# Altium project Score.PrjPCB (part 1 of 2)
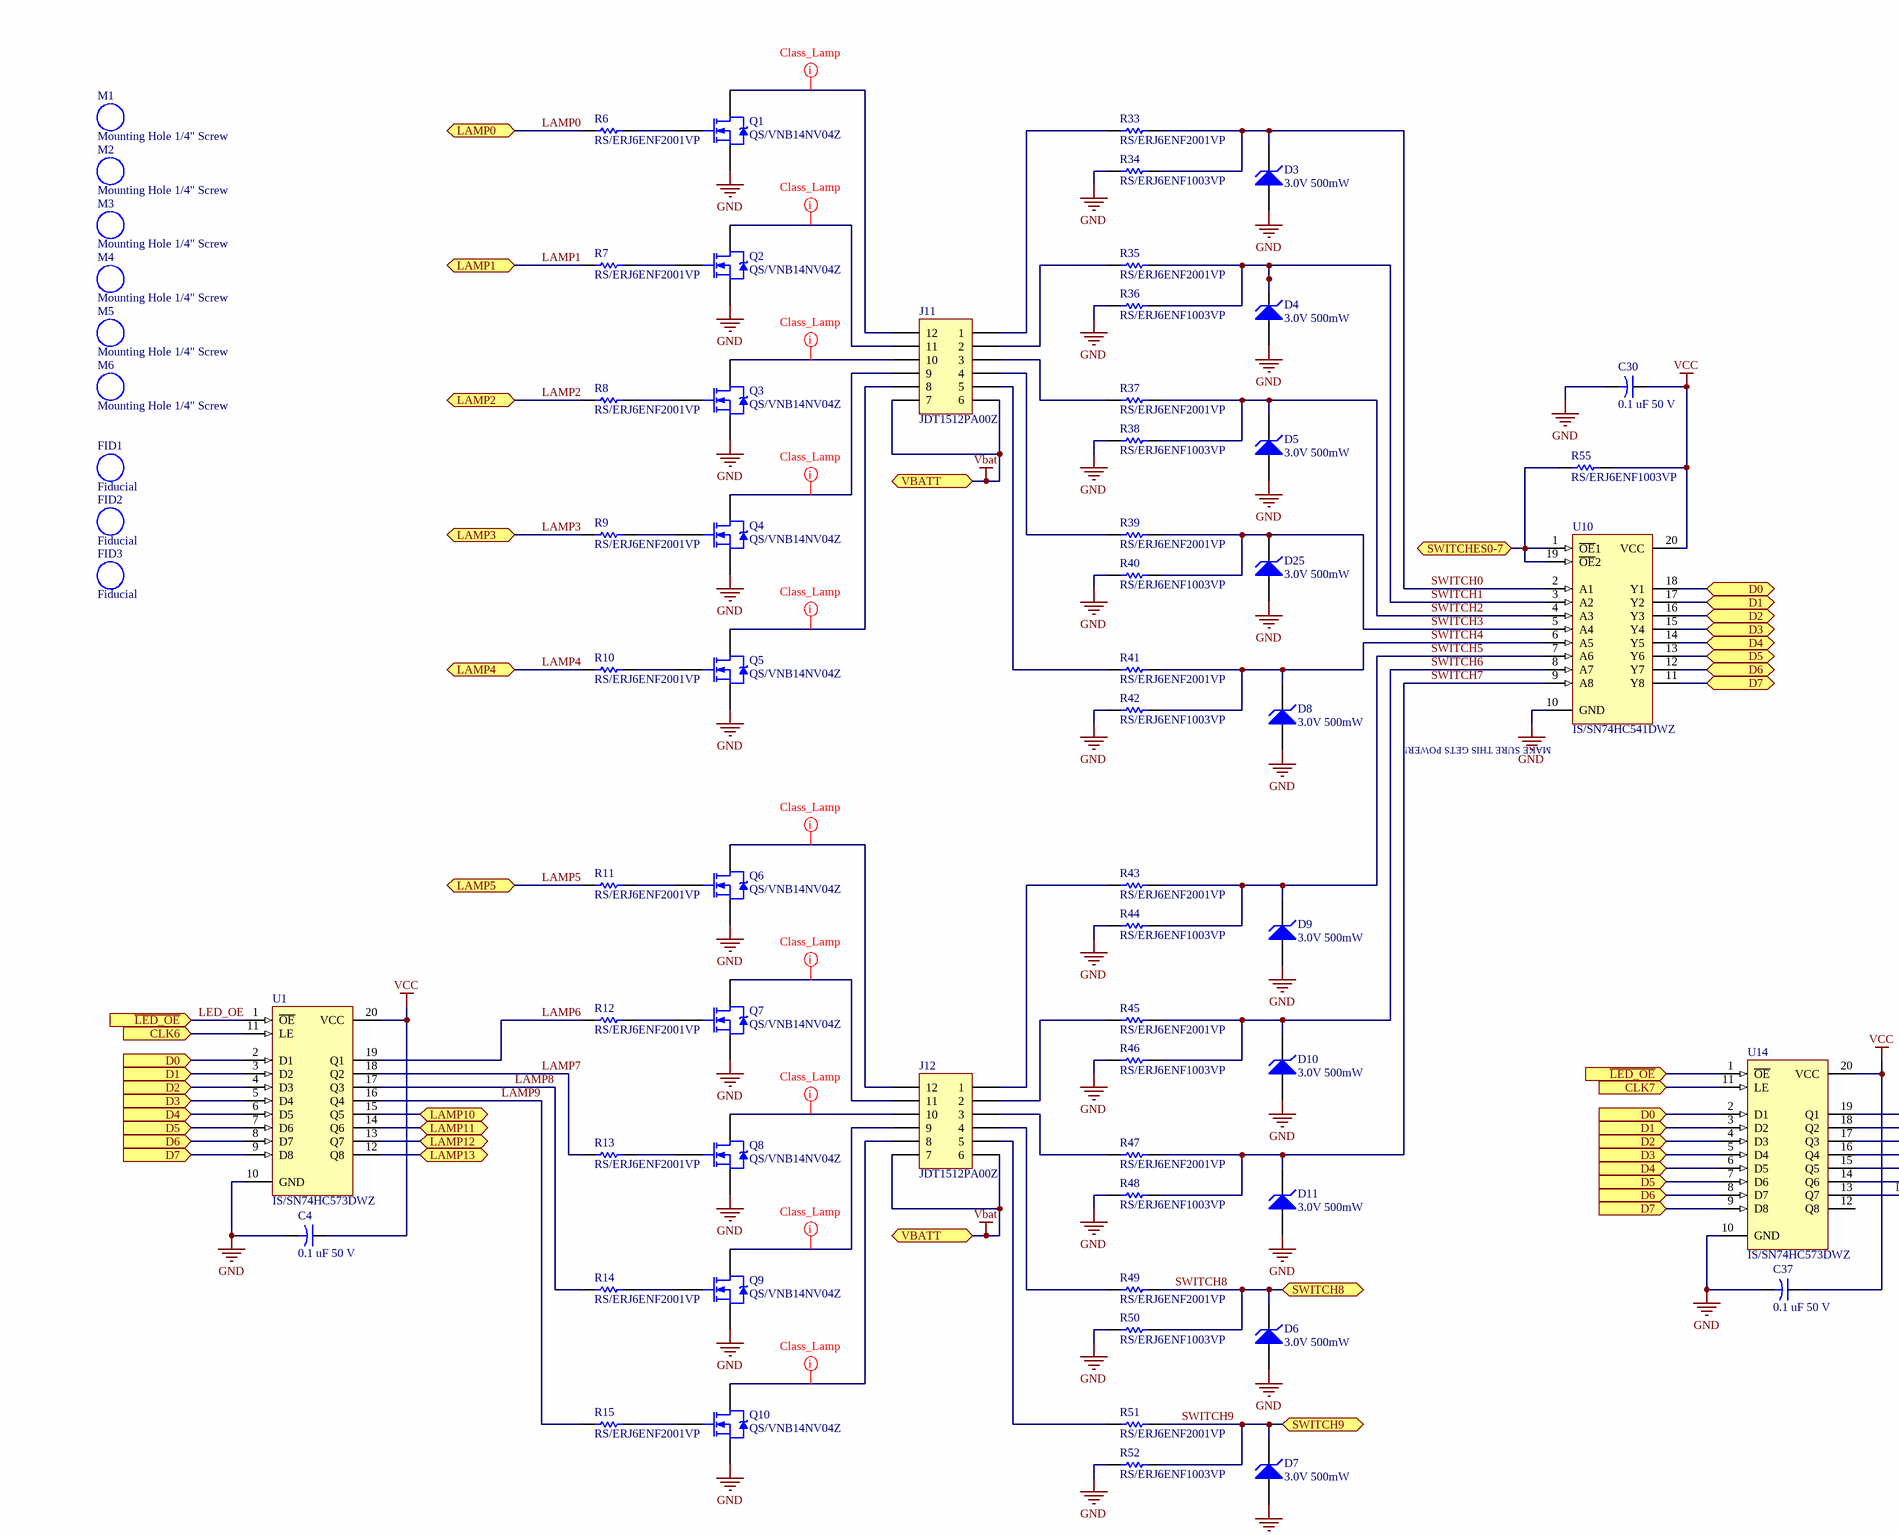
[diagram p0: Score V4.SchDoc, top left]
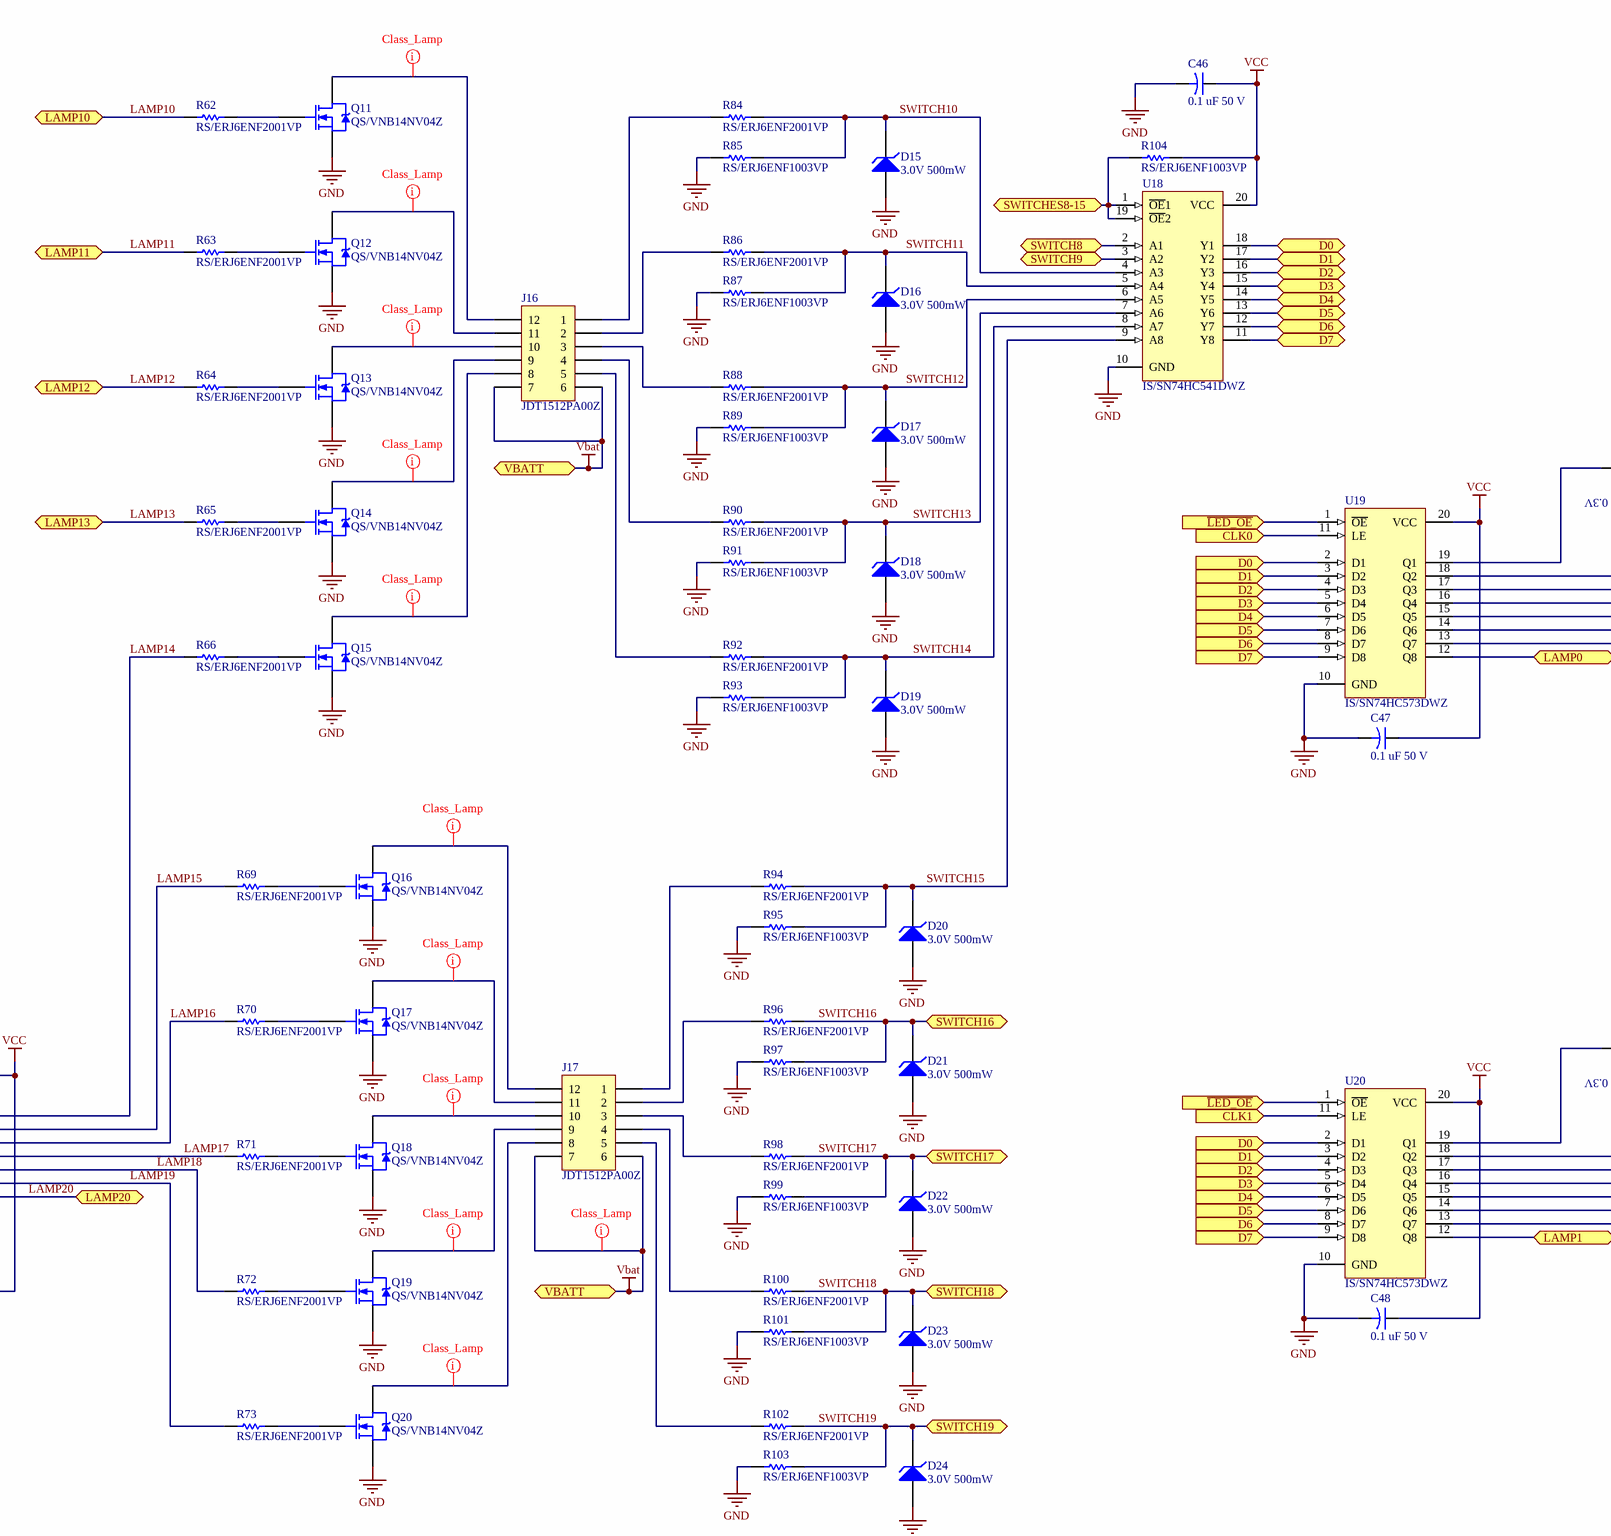
[diagram p1: Score V4.SchDoc, top middle]
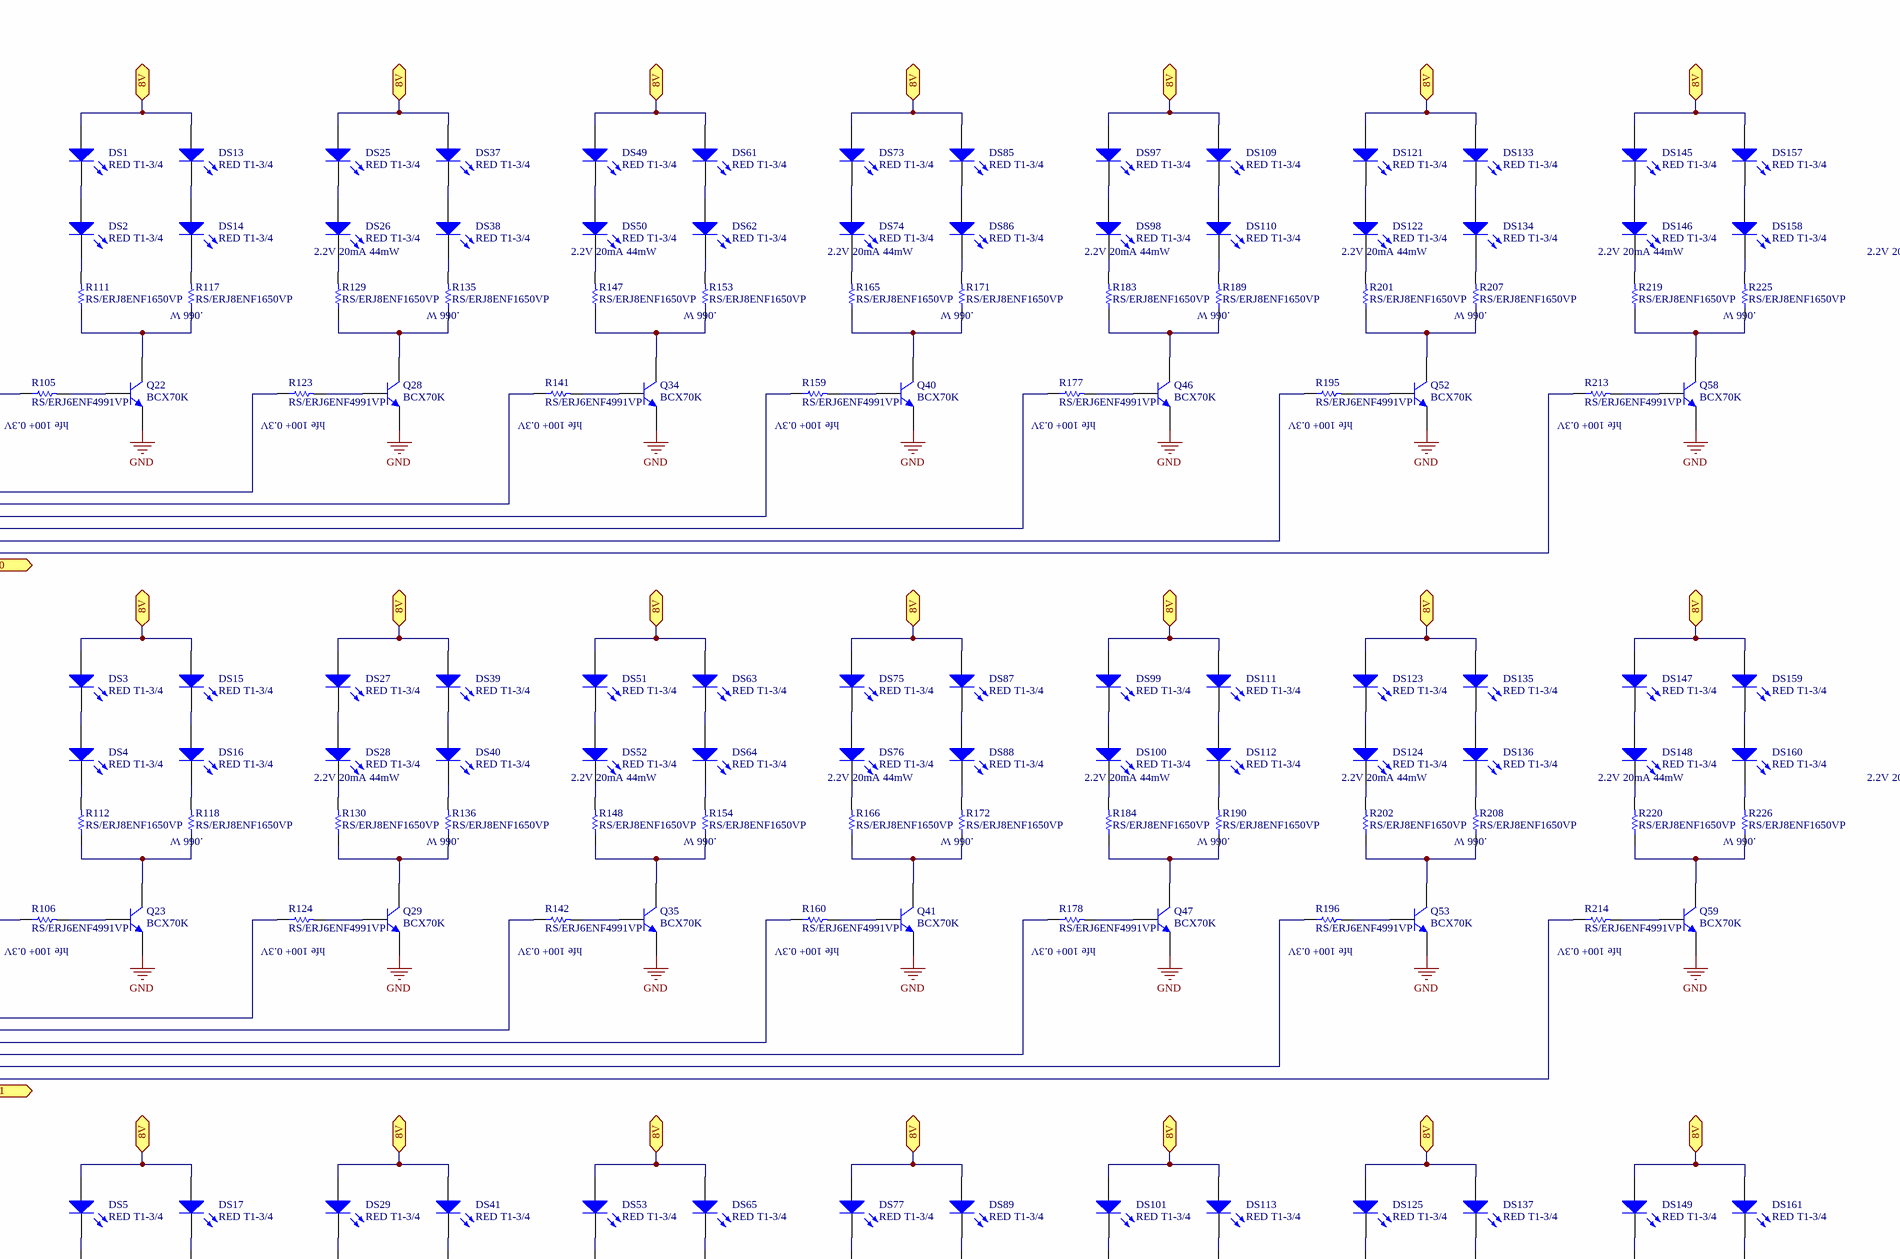
[diagram p2: Score V4.SchDoc, top right]
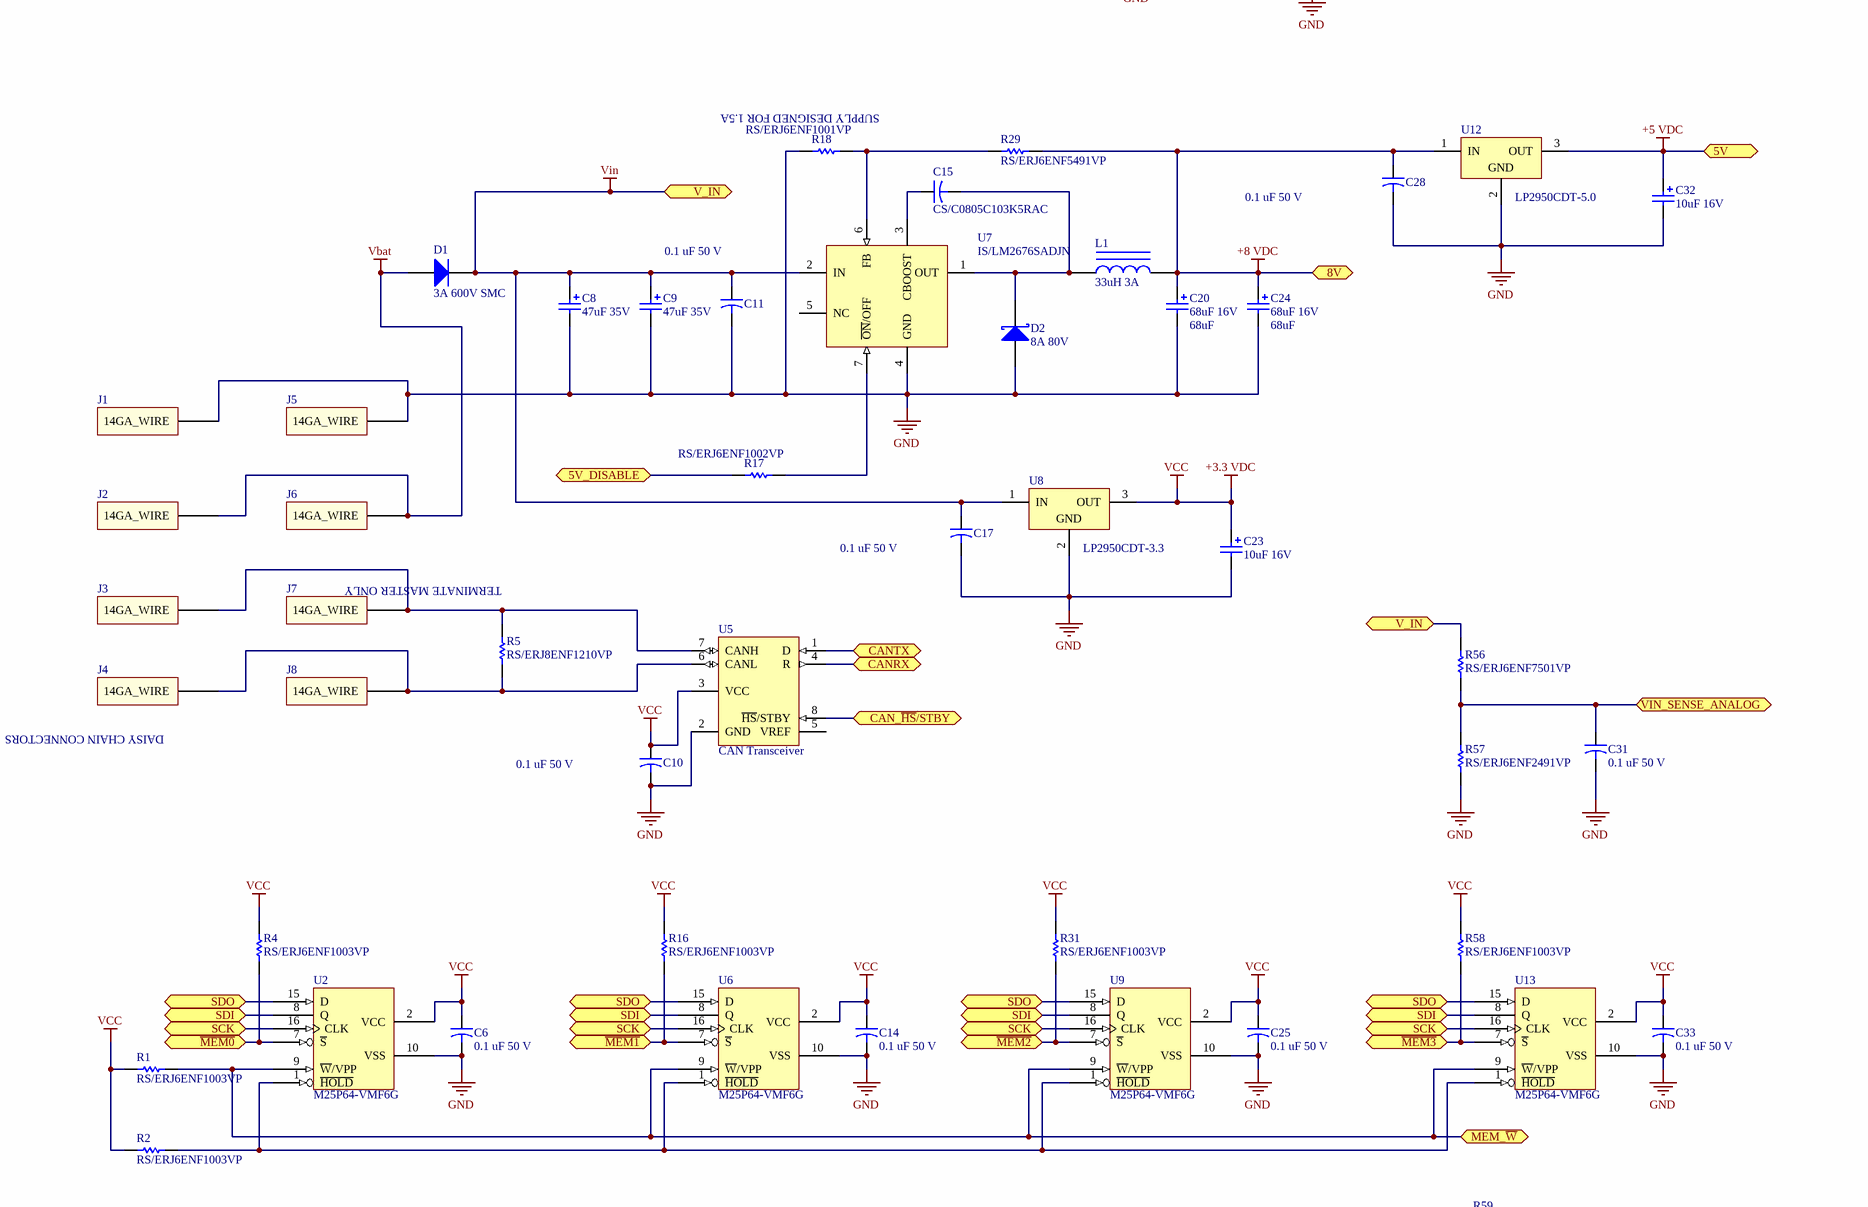
[diagram p3: Score V4.SchDoc, centre left]
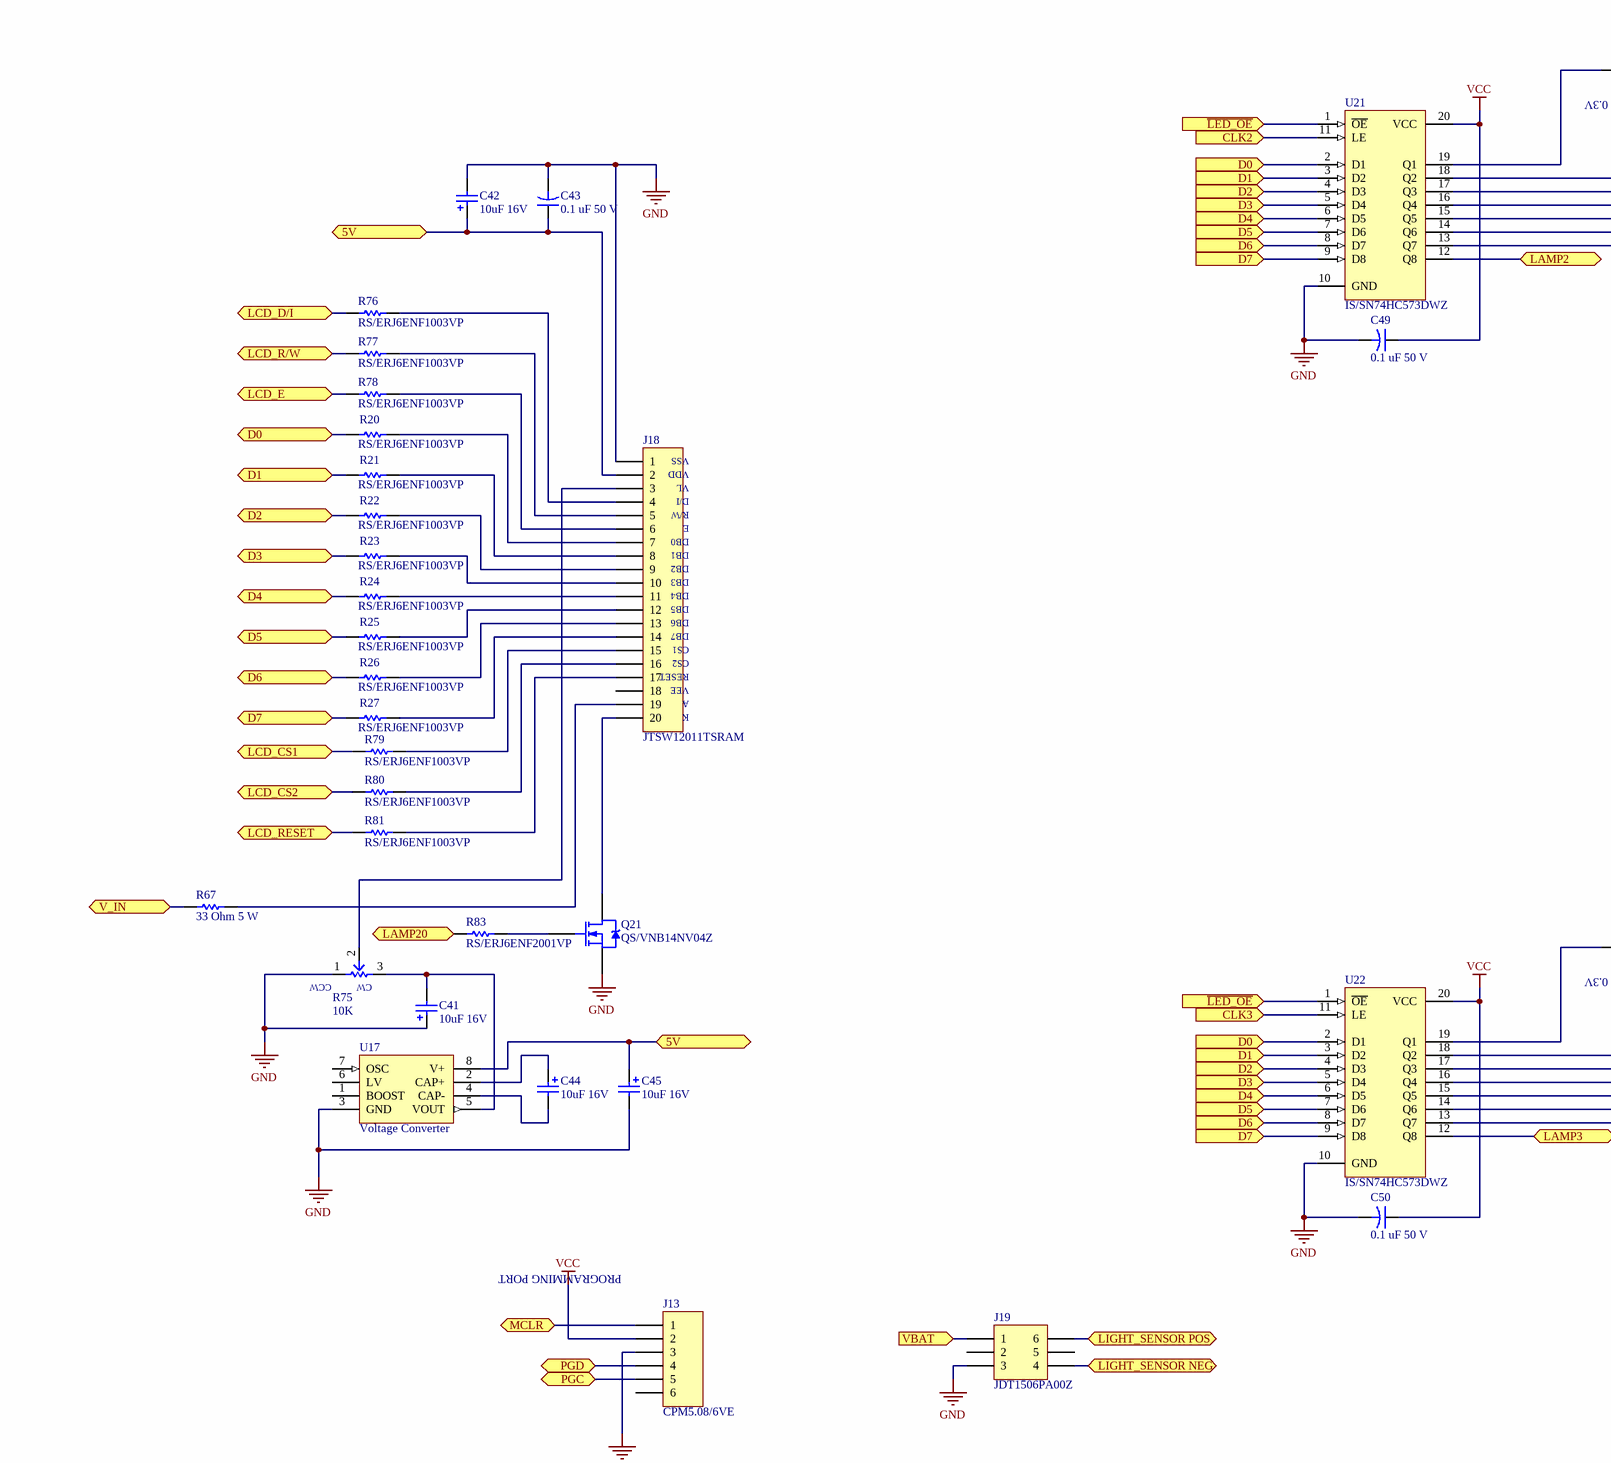
[diagram p4: Score V4.SchDoc, centre middle]
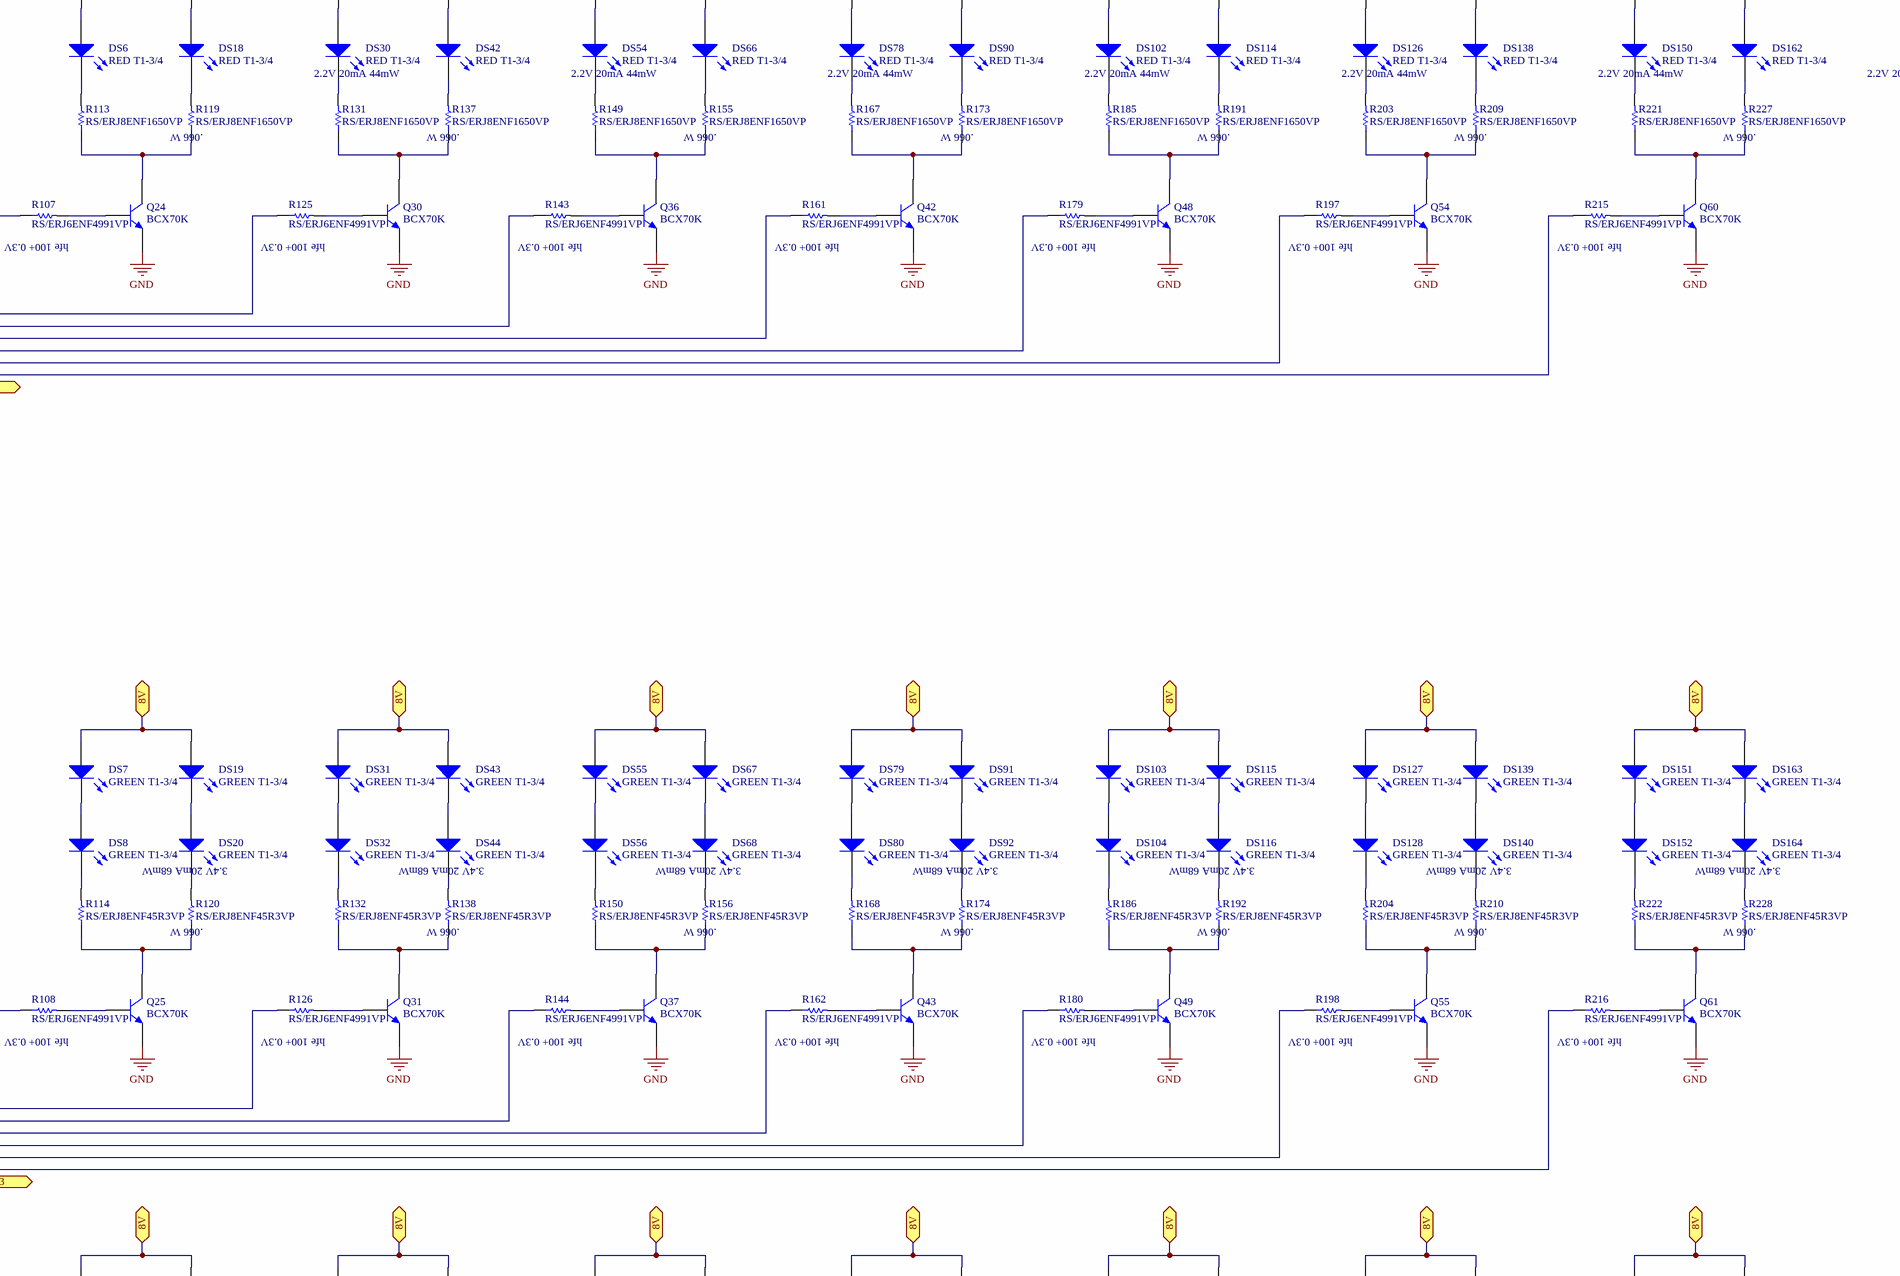
[diagram p5: Score V4.SchDoc, centre right]
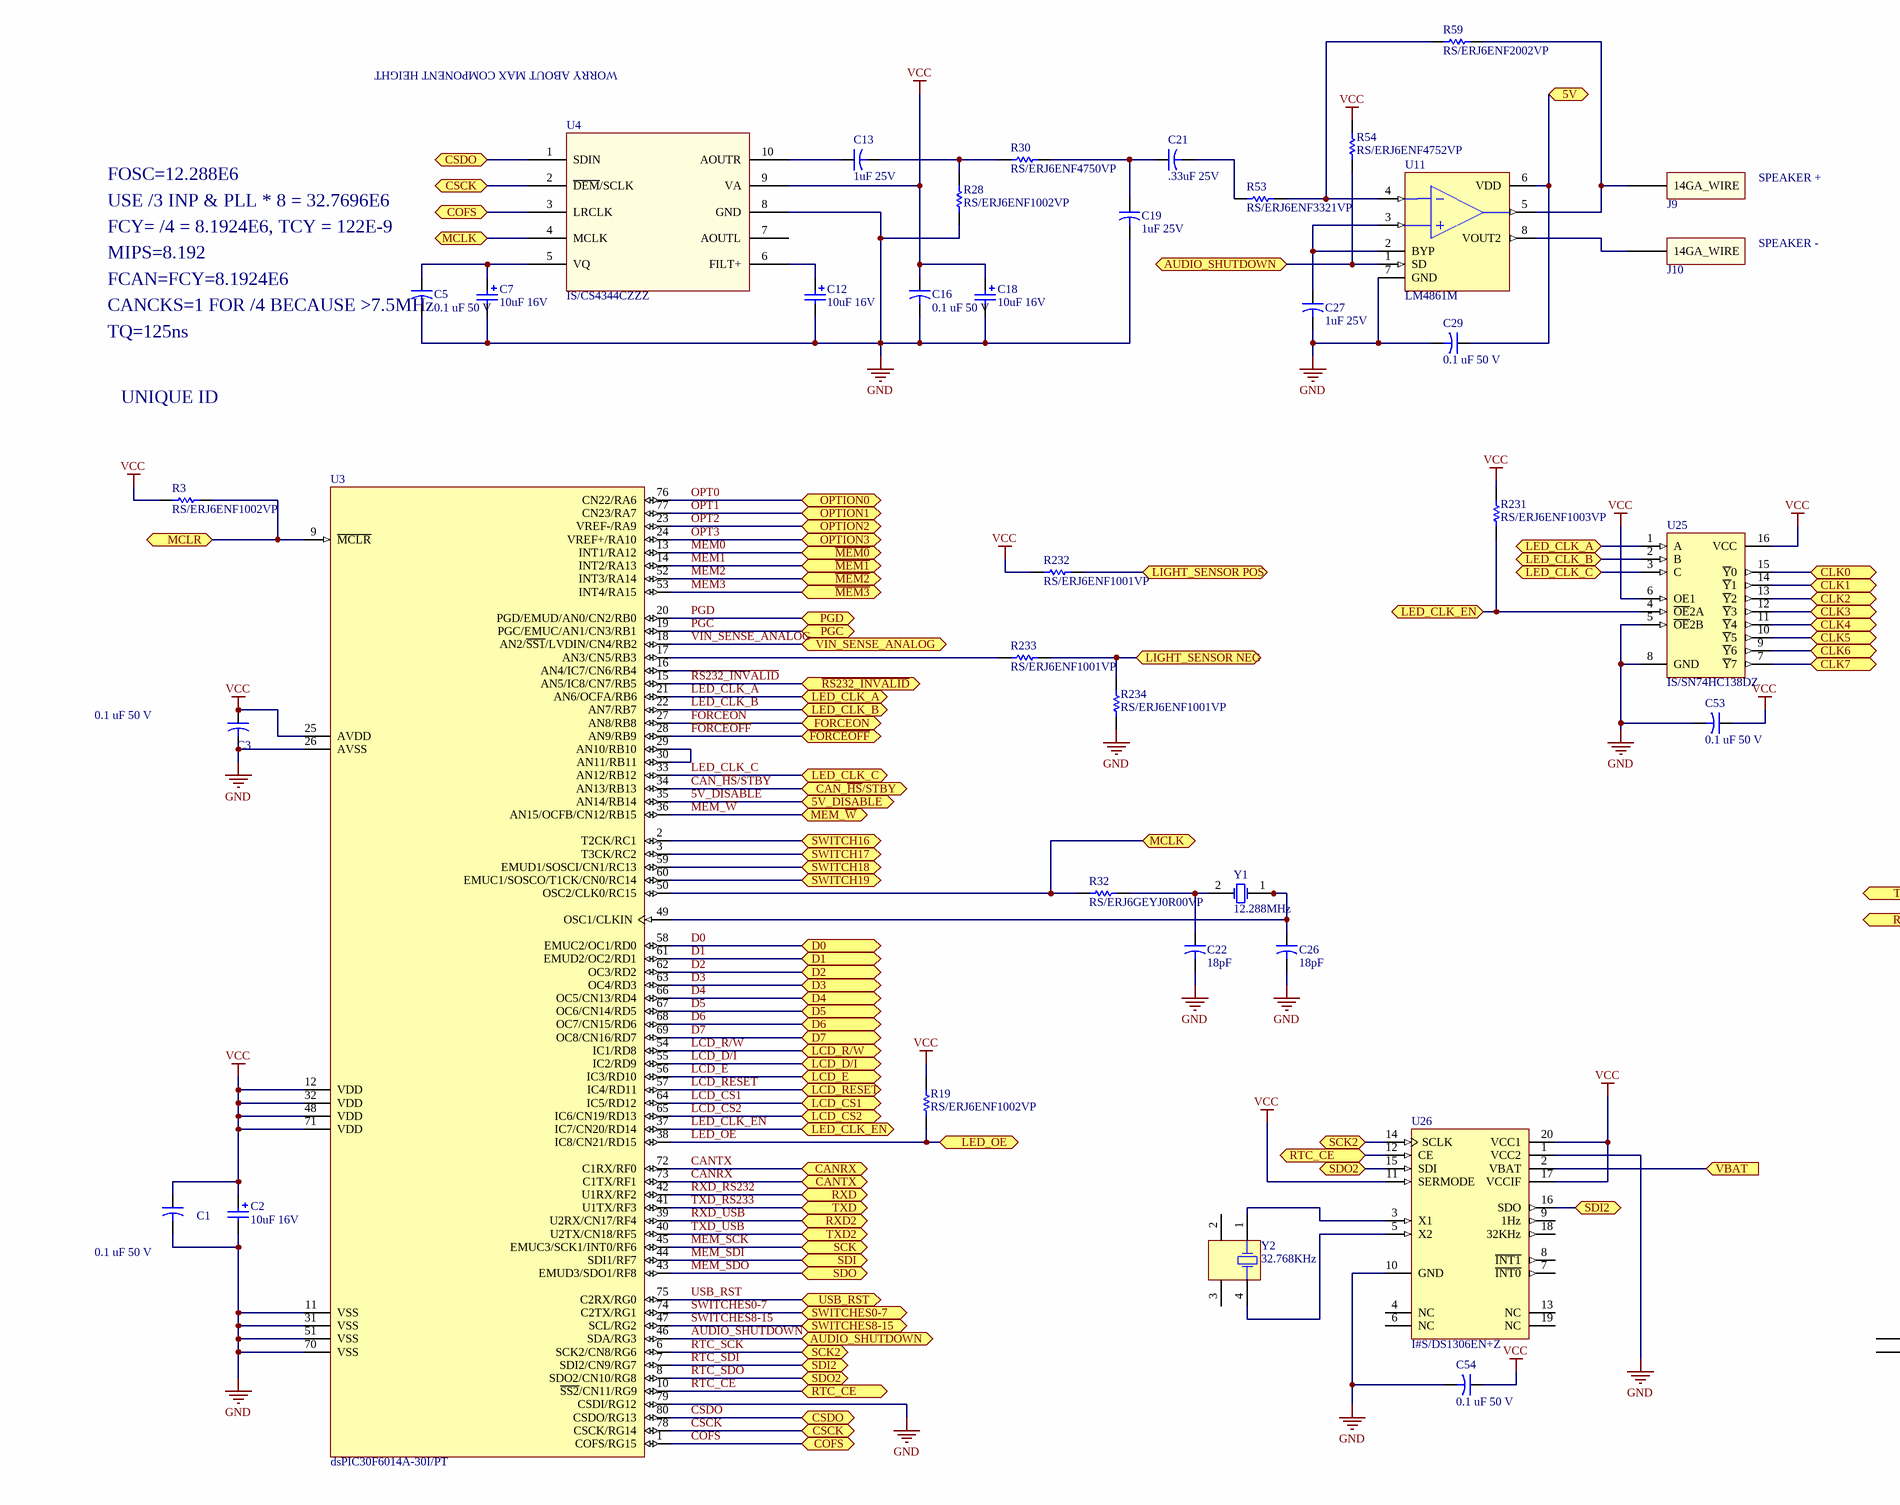
[diagram p6: Score V4.SchDoc, bottom left]
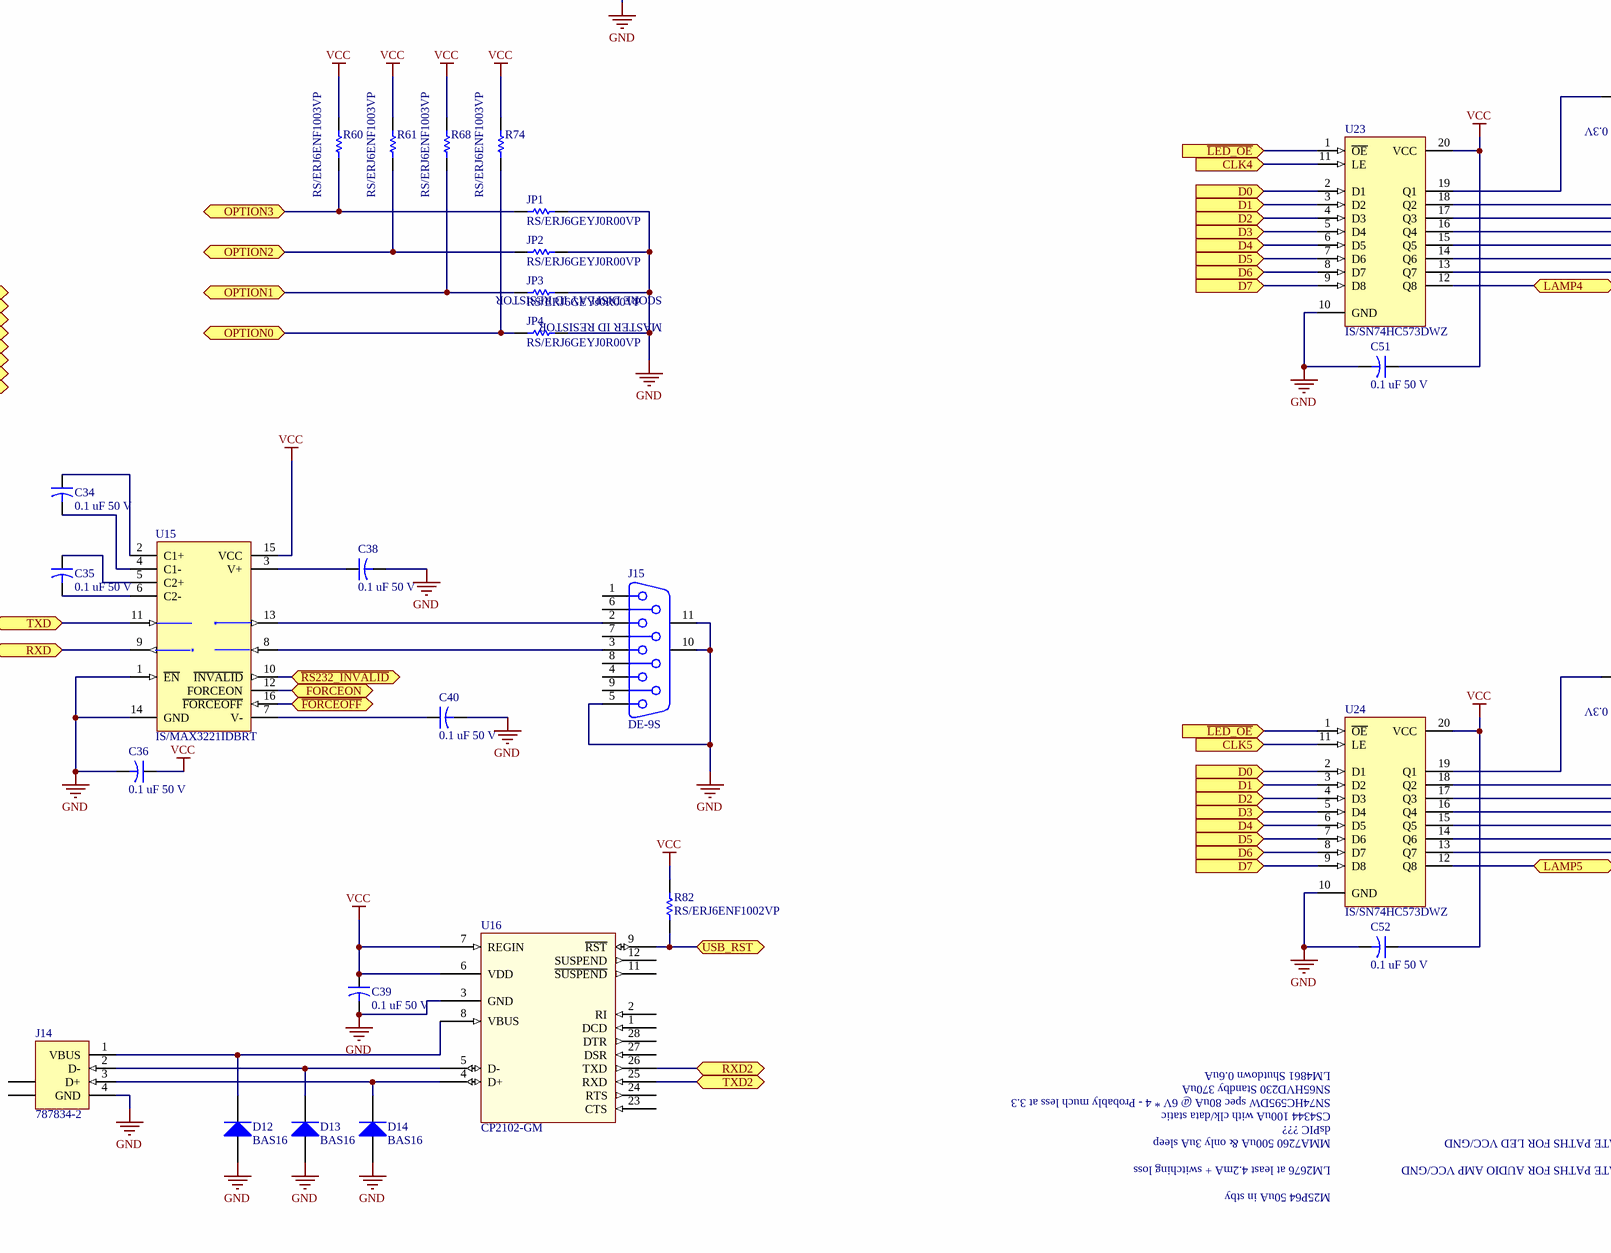
[diagram p7: Score V4.SchDoc, bottom middle]
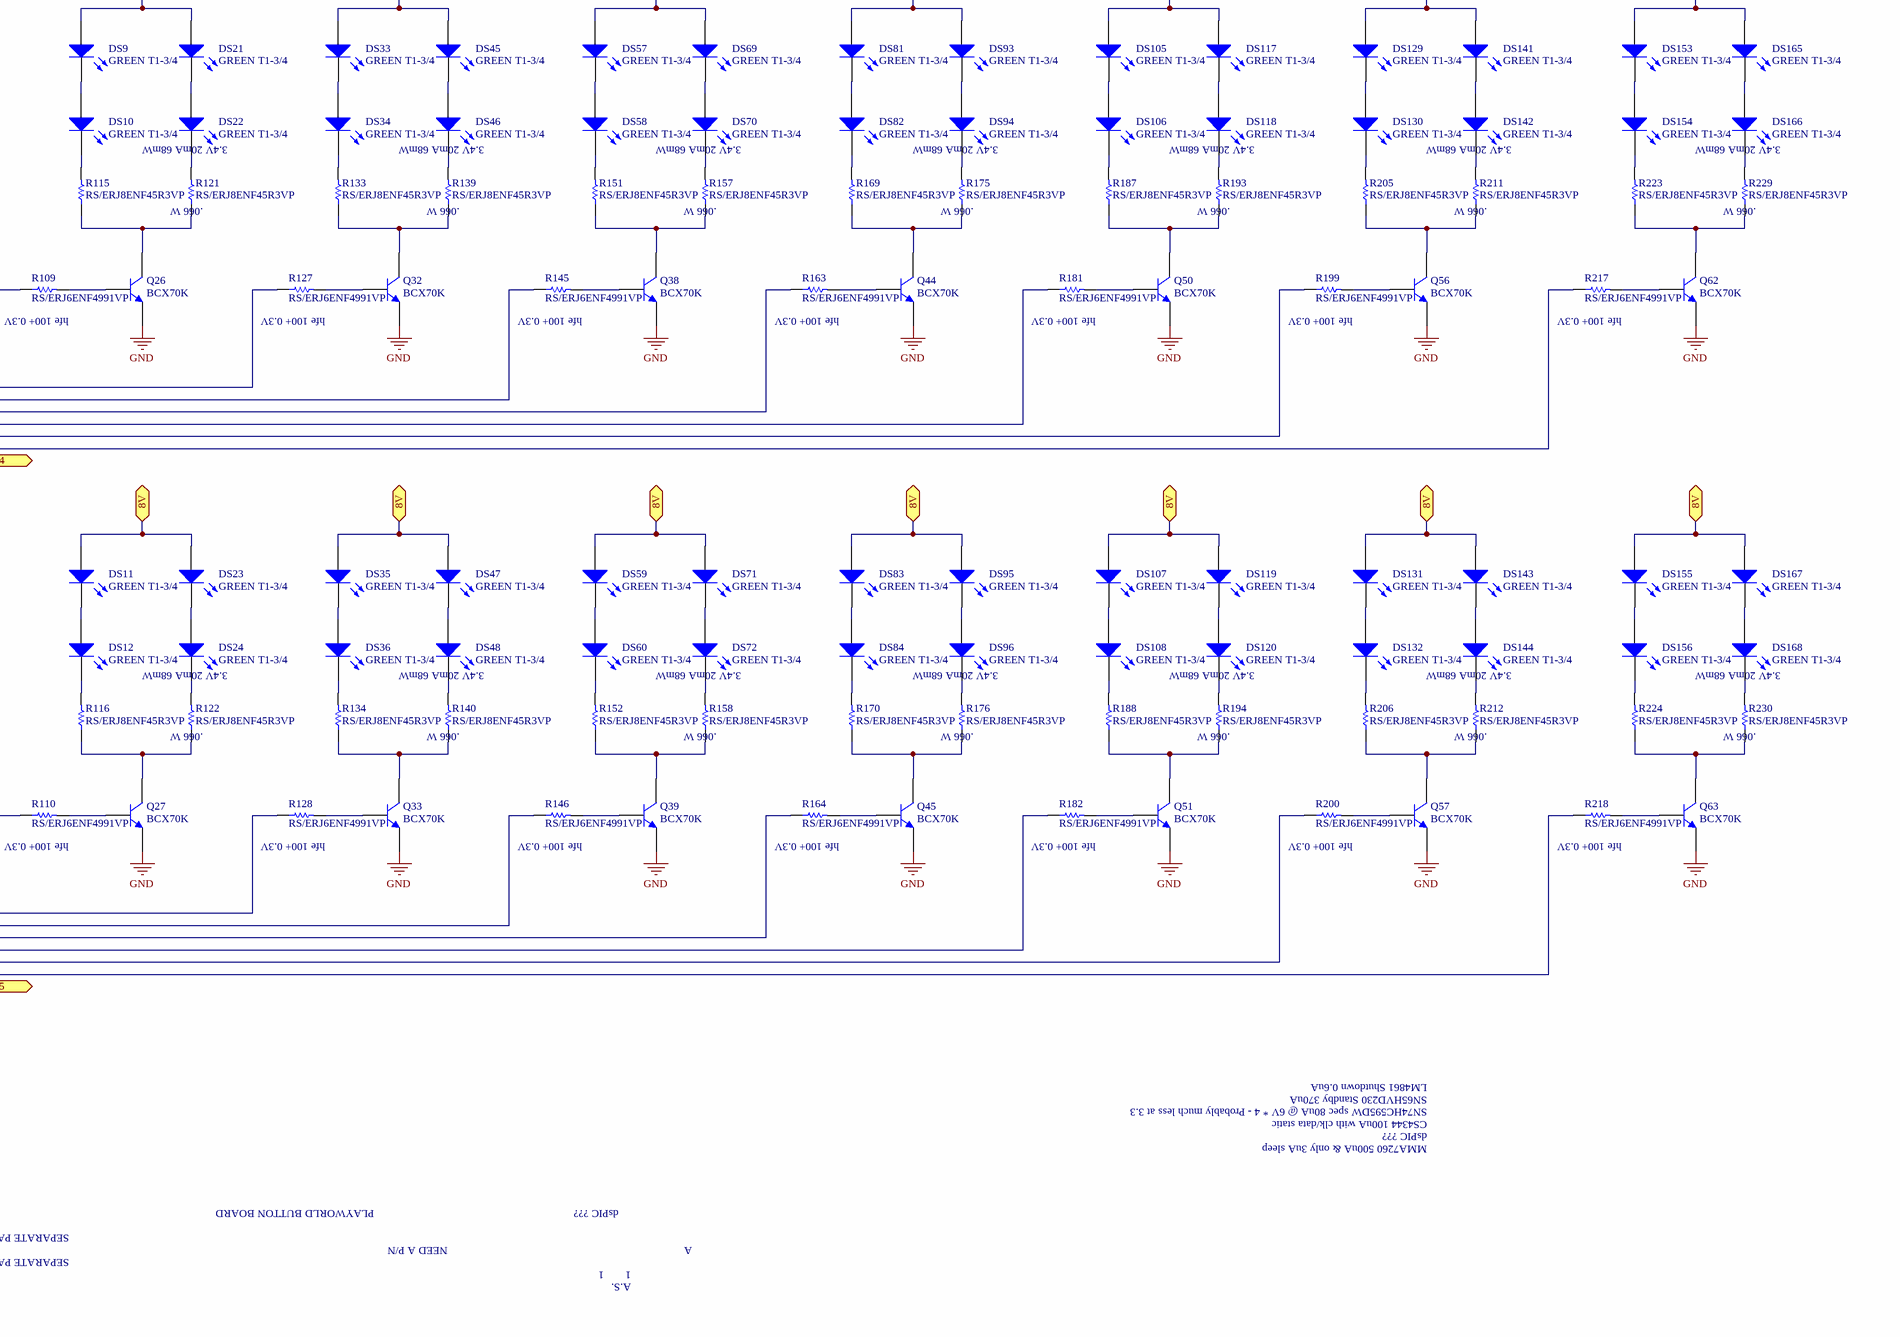
[diagram p8: Score V4.SchDoc, bottom right]
1 sheet, 605 parts. Net scope: flat (ports and power ports of the same name join across sheets).
Board file: ScoreLED.PcbDoc

## Sheet Score V4.SchDoc
size E; PageSetup: Record=PageOptions|CenterHorizontal=True|CenterVertical=True|PrintScale=0.33|XCorrection=1.00|YCorrection=1.00|PrintKind=2|BorderSize=5000000|LeftOffset=0|BottomOffset=0|Orientation=2|PaperLength=1000|PaperWidth=1000|Scale=100|PaperSource=15|PrintQuality=1200|MediaType=1|DitherType=10|PaperKind=11x17|PrintScaleMode=1

### Parts
C1  0.1 uF 50 V  [C0805]
C2  10uF 16V  [C4X5.8]
C3  0.1 uF 50 V  [C0805]
C4  0.1 uF 50 V  [C0805]
C5  0.1 uF 50 V  [C0805]
C6  0.1 uF 50 V  [C0805]  (no BOM)
C7  10uF 16V  [C4X5.8]
C8  47uF 35V  [C EIA7343-43 (X)]
C9  47uF 35V  [C EIA7343-43 (X)]
C10  0.1 uF 50 V  [C0805]
C11  0.1 uF 50 V  [C0805]
C12  10uF 16V  [C4X5.8]
C13  1uF 25V  [R1206]
C14  0.1 uF 50 V  [C0805]  (no BOM)
C15  CS/C0805C103K5RAC  [C0805]
C16  0.1 uF 50 V  [C0805]
C17  0.1 uF 50 V  [C0805]
C18  10uF 16V  [C4X5.8]
C19  1uF 25V  [R1206]
C20  68uF 16V  value 68uF  [C7343]
C21  .33uF 25V  [R1206]
C22  18pF  [C0805]
C23  10uF 16V  [C4X5.8]
C24  68uF 16V  value 68uF  [C7343]
C25  0.1 uF 50 V  [C0805]  (no BOM)
C26  18pF  [C0805]
C27  1uF 25V  [R1206]
C28  0.1 uF 50 V  [C0805]
C29  0.1 uF 50 V  [C0805]
C30  0.1 uF 50 V  [C0805]
C31  0.1 uF 50 V  [C0805]
C32  10uF 16V  [C4X5.8]
C33  0.1 uF 50 V  [C0805]  (no BOM)
C34  0.1 uF 50 V  [C0805]  (no BOM)
C35  0.1 uF 50 V  [C0805]  (no BOM)
C36  0.1 uF 50 V  [C0805]  (no BOM)
C37  0.1 uF 50 V  [C0805]
C38  0.1 uF 50 V  [C0805]  (no BOM)
C39  0.1 uF 50 V  [C0805]  (no BOM)
C40  0.1 uF 50 V  [C0805]  (no BOM)
C41  10uF 16V  [C4X5.8]
C42  10uF 16V  [C4X5.8]
C43  0.1 uF 50 V  [C0805]
C44  10uF 16V  [C4X5.8]
C45  10uF 16V  [C4X5.8]
C46  0.1 uF 50 V  [C0805]
C47  0.1 uF 50 V  [C0805]
C48  0.1 uF 50 V  [C0805]
C49  0.1 uF 50 V  [C0805]
C50  0.1 uF 50 V  [C0805]
C51  0.1 uF 50 V  [C0805]
C52  0.1 uF 50 V  [C0805]
C53  0.1 uF 50 V  [C0805]
C54  0.1 uF 50 V  [C0805]
D1  3A 600V SMC  [DIODE_SMC]
D2  8A 80V  [D2PAK]
D3  3.0V 500mW  [SOD123]
D4  3.0V 500mW  [SOD123]
D5  3.0V 500mW  [SOD123]
D6  3.0V 500mW  [SOD123]
D7  3.0V 500mW  [SOD123]
D8  3.0V 500mW  [SOD123]
D9  3.0V 500mW  [SOD123]
D10  3.0V 500mW  [SOD123]
D11  3.0V 500mW  [SOD123]
D12  BAS16  [SOT23]  (no BOM)
D13  BAS16  [SOT23]  (no BOM)
D14  BAS16  [SOT23]  (no BOM)
D15  3.0V 500mW  [SOD123]
D16  3.0V 500mW  [SOD123]
D17  3.0V 500mW  [SOD123]
D18  3.0V 500mW  [SOD123]
D19  3.0V 500mW  [SOD123]
D20  3.0V 500mW  [SOD123]
D21  3.0V 500mW  [SOD123]
D22  3.0V 500mW  [SOD123]
D23  3.0V 500mW  [SOD123]
D24  3.0V 500mW  [SOD123]
D25  3.0V 500mW  [SOD123]
DS1  RED T1-3/4  [LED T1-3/4 Flush]
DS2  RED T1-3/4  [LED T1-3/4 Flush]
DS3  RED T1-3/4  [LED T1-3/4 Flush]
DS4  RED T1-3/4  [LED T1-3/4 Flush]
DS5  RED T1-3/4  [LED T1-3/4 Flush]
DS6  RED T1-3/4  [LED T1-3/4 Flush]
DS7  GREEN T1-3/4  [LED T1-3/4 Flush]
DS8  GREEN T1-3/4  [LED T1-3/4 Flush]
DS9  GREEN T1-3/4  [LED T1-3/4 Flush]
DS10  GREEN T1-3/4  [LED T1-3/4 Flush]
DS11  GREEN T1-3/4  [LED T1-3/4 Flush]
DS12  GREEN T1-3/4  [LED T1-3/4 Flush]
DS13  RED T1-3/4  [LED T1-3/4 Flush]
DS14  RED T1-3/4  [LED T1-3/4 Flush]
DS15  RED T1-3/4  [LED T1-3/4 Flush]
DS16  RED T1-3/4  [LED T1-3/4 Flush]
DS17  RED T1-3/4  [LED T1-3/4 Flush]
DS18  RED T1-3/4  [LED T1-3/4 Flush]
DS19  GREEN T1-3/4  [LED T1-3/4 Flush]
DS20  GREEN T1-3/4  [LED T1-3/4 Flush]
DS21  GREEN T1-3/4  [LED T1-3/4 Flush]
DS22  GREEN T1-3/4  [LED T1-3/4 Flush]
DS23  GREEN T1-3/4  [LED T1-3/4 Flush]
DS24  GREEN T1-3/4  [LED T1-3/4 Flush]
DS25  RED T1-3/4  [LED T1-3/4 Flush]
DS26  RED T1-3/4  [LED T1-3/4 Flush]
DS27  RED T1-3/4  [LED T1-3/4 Flush]
DS28  RED T1-3/4  [LED T1-3/4 Flush]
DS29  RED T1-3/4  [LED T1-3/4 Flush]
DS30  RED T1-3/4  [LED T1-3/4 Flush]
DS31  GREEN T1-3/4  [LED T1-3/4 Flush]
DS32  GREEN T1-3/4  [LED T1-3/4 Flush]
DS33  GREEN T1-3/4  [LED T1-3/4 Flush]
DS34  GREEN T1-3/4  [LED T1-3/4 Flush]
DS35  GREEN T1-3/4  [LED T1-3/4 Flush]
DS36  GREEN T1-3/4  [LED T1-3/4 Flush]
DS37  RED T1-3/4  [LED T1-3/4 Flush]
DS38  RED T1-3/4  [LED T1-3/4 Flush]
DS39  RED T1-3/4  [LED T1-3/4 Flush]
DS40  RED T1-3/4  [LED T1-3/4 Flush]
DS41  RED T1-3/4  [LED T1-3/4 Flush]
DS42  RED T1-3/4  [LED T1-3/4 Flush]
DS43  GREEN T1-3/4  [LED T1-3/4 Flush]
DS44  GREEN T1-3/4  [LED T1-3/4 Flush]
DS45  GREEN T1-3/4  [LED T1-3/4 Flush]
DS46  GREEN T1-3/4  [LED T1-3/4 Flush]
DS47  GREEN T1-3/4  [LED T1-3/4 Flush]
DS48  GREEN T1-3/4  [LED T1-3/4 Flush]
DS49  RED T1-3/4  [LED T1-3/4 Flush]
DS50  RED T1-3/4  [LED T1-3/4 Flush]
DS51  RED T1-3/4  [LED T1-3/4 Flush]
DS52  RED T1-3/4  [LED T1-3/4 Flush]
DS53  RED T1-3/4  [LED T1-3/4 Flush]
DS54  RED T1-3/4  [LED T1-3/4 Flush]
DS55  GREEN T1-3/4  [LED T1-3/4 Flush]
DS56  GREEN T1-3/4  [LED T1-3/4 Flush]
DS57  GREEN T1-3/4  [LED T1-3/4 Flush]
DS58  GREEN T1-3/4  [LED T1-3/4 Flush]
DS59  GREEN T1-3/4  [LED T1-3/4 Flush]
DS60  GREEN T1-3/4  [LED T1-3/4 Flush]
DS61  RED T1-3/4  [LED T1-3/4 Flush]
DS62  RED T1-3/4  [LED T1-3/4 Flush]
DS63  RED T1-3/4  [LED T1-3/4 Flush]
DS64  RED T1-3/4  [LED T1-3/4 Flush]
DS65  RED T1-3/4  [LED T1-3/4 Flush]
DS66  RED T1-3/4  [LED T1-3/4 Flush]
DS67  GREEN T1-3/4  [LED T1-3/4 Flush]
DS68  GREEN T1-3/4  [LED T1-3/4 Flush]
DS69  GREEN T1-3/4  [LED T1-3/4 Flush]
DS70  GREEN T1-3/4  [LED T1-3/4 Flush]
DS71  GREEN T1-3/4  [LED T1-3/4 Flush]
DS72  GREEN T1-3/4  [LED T1-3/4 Flush]
DS73  RED T1-3/4  [LED T1-3/4 Flush]
DS74  RED T1-3/4  [LED T1-3/4 Flush]
DS75  RED T1-3/4  [LED T1-3/4 Flush]
DS76  RED T1-3/4  [LED T1-3/4 Flush]
DS77  RED T1-3/4  [LED T1-3/4 Flush]
DS78  RED T1-3/4  [LED T1-3/4 Flush]
DS79  GREEN T1-3/4  [LED T1-3/4 Flush]
DS80  GREEN T1-3/4  [LED T1-3/4 Flush]
DS81  GREEN T1-3/4  [LED T1-3/4 Flush]
DS82  GREEN T1-3/4  [LED T1-3/4 Flush]
DS83  GREEN T1-3/4  [LED T1-3/4 Flush]
DS84  GREEN T1-3/4  [LED T1-3/4 Flush]
DS85  RED T1-3/4  [LED T1-3/4 Flush]
DS86  RED T1-3/4  [LED T1-3/4 Flush]
DS87  RED T1-3/4  [LED T1-3/4 Flush]
DS88  RED T1-3/4  [LED T1-3/4 Flush]
DS89  RED T1-3/4  [LED T1-3/4 Flush]
DS90  RED T1-3/4  [LED T1-3/4 Flush]
DS91  GREEN T1-3/4  [LED T1-3/4 Flush]
DS92  GREEN T1-3/4  [LED T1-3/4 Flush]
DS93  GREEN T1-3/4  [LED T1-3/4 Flush]
DS94  GREEN T1-3/4  [LED T1-3/4 Flush]
DS95  GREEN T1-3/4  [LED T1-3/4 Flush]
DS96  GREEN T1-3/4  [LED T1-3/4 Flush]
DS97  RED T1-3/4  [LED T1-3/4 Flush]
DS98  RED T1-3/4  [LED T1-3/4 Flush]
DS99  RED T1-3/4  [LED T1-3/4 Flush]
DS100  RED T1-3/4  [LED T1-3/4 Flush]
DS101  RED T1-3/4  [LED T1-3/4 Flush]
DS102  RED T1-3/4  [LED T1-3/4 Flush]
DS103  GREEN T1-3/4  [LED T1-3/4 Flush]
DS104  GREEN T1-3/4  [LED T1-3/4 Flush]
DS105  GREEN T1-3/4  [LED T1-3/4 Flush]
DS106  GREEN T1-3/4  [LED T1-3/4 Flush]
DS107  GREEN T1-3/4  [LED T1-3/4 Flush]
DS108  GREEN T1-3/4  [LED T1-3/4 Flush]
DS109  RED T1-3/4  [LED T1-3/4 Flush]
DS110  RED T1-3/4  [LED T1-3/4 Flush]
DS111  RED T1-3/4  [LED T1-3/4 Flush]
DS112  RED T1-3/4  [LED T1-3/4 Flush]
DS113  RED T1-3/4  [LED T1-3/4 Flush]
DS114  RED T1-3/4  [LED T1-3/4 Flush]
DS115  GREEN T1-3/4  [LED T1-3/4 Flush]
DS116  GREEN T1-3/4  [LED T1-3/4 Flush]
DS117  GREEN T1-3/4  [LED T1-3/4 Flush]
DS118  GREEN T1-3/4  [LED T1-3/4 Flush]
DS119  GREEN T1-3/4  [LED T1-3/4 Flush]
DS120  GREEN T1-3/4  [LED T1-3/4 Flush]
DS121  RED T1-3/4  [LED T1-3/4 Flush]
DS122  RED T1-3/4  [LED T1-3/4 Flush]
DS123  RED T1-3/4  [LED T1-3/4 Flush]
DS124  RED T1-3/4  [LED T1-3/4 Flush]
DS125  RED T1-3/4  [LED T1-3/4 Flush]
DS126  RED T1-3/4  [LED T1-3/4 Flush]
DS127  GREEN T1-3/4  [LED T1-3/4 Flush]
DS128  GREEN T1-3/4  [LED T1-3/4 Flush]
DS129  GREEN T1-3/4  [LED T1-3/4 Flush]
DS130  GREEN T1-3/4  [LED T1-3/4 Flush]
DS131  GREEN T1-3/4  [LED T1-3/4 Flush]
DS132  GREEN T1-3/4  [LED T1-3/4 Flush]
DS133  RED T1-3/4  [LED T1-3/4 Flush]
DS134  RED T1-3/4  [LED T1-3/4 Flush]
DS135  RED T1-3/4  [LED T1-3/4 Flush]
DS136  RED T1-3/4  [LED T1-3/4 Flush]
DS137  RED T1-3/4  [LED T1-3/4 Flush]
DS138  RED T1-3/4  [LED T1-3/4 Flush]
DS139  GREEN T1-3/4  [LED T1-3/4 Flush]
DS140  GREEN T1-3/4  [LED T1-3/4 Flush]
DS141  GREEN T1-3/4  [LED T1-3/4 Flush]
DS142  GREEN T1-3/4  [LED T1-3/4 Flush]
DS143  GREEN T1-3/4  [LED T1-3/4 Flush]
DS144  GREEN T1-3/4  [LED T1-3/4 Flush]
DS145  RED T1-3/4  [LED T1-3/4 Flush]
DS146  RED T1-3/4  [LED T1-3/4 Flush]
DS147  RED T1-3/4  [LED T1-3/4 Flush]
DS148  RED T1-3/4  [LED T1-3/4 Flush]
DS149  RED T1-3/4  [LED T1-3/4 Flush]
DS150  RED T1-3/4  [LED T1-3/4 Flush]
DS151  GREEN T1-3/4  [LED T1-3/4 Flush]
DS152  GREEN T1-3/4  [LED T1-3/4 Flush]
DS153  GREEN T1-3/4  [LED T1-3/4 Flush]
DS154  GREEN T1-3/4  [LED T1-3/4 Flush]
DS155  GREEN T1-3/4  [LED T1-3/4 Flush]
DS156  GREEN T1-3/4  [LED T1-3/4 Flush]
DS157  RED T1-3/4  [LED T1-3/4 Flush]
DS158  RED T1-3/4  [LED T1-3/4 Flush]
DS159  RED T1-3/4  [LED T1-3/4 Flush]
DS160  RED T1-3/4  [LED T1-3/4 Flush]
DS161  RED T1-3/4  [LED T1-3/4 Flush]
DS162  RED T1-3/4  [LED T1-3/4 Flush]
DS163  GREEN T1-3/4  [LED T1-3/4 Flush]
DS164  GREEN T1-3/4  [LED T1-3/4 Flush]
DS165  GREEN T1-3/4  [LED T1-3/4 Flush]
DS166  GREEN T1-3/4  [LED T1-3/4 Flush]
DS167  GREEN T1-3/4  [LED T1-3/4 Flush]
DS168  GREEN T1-3/4  [LED T1-3/4 Flush]
FID1  Fiducial  [Fiducial]  (no BOM)
FID2  Fiducial  [Fiducial]  (no BOM)
FID3  Fiducial  [Fiducial]  (no BOM)
J1  ~14GA_WIRE  [WIRE_14GA]  (value not drawn)  (no BOM)
J2  ~14GA_WIRE  [WIRE_14GA]  (value not drawn)  (no BOM)
J3  ~14GA_WIRE  [WIRE_14GA]  (value not drawn)  (no BOM)
J4  ~14GA_WIRE  [WIRE_14GA]  (value not drawn)  (no BOM)
J5  ~14GA_WIRE  [WIRE_14GA]  (value not drawn)  (no BOM)
J6  ~14GA_WIRE  [WIRE_14GA]  (value not drawn)  (no BOM)
J7  ~14GA_WIRE  [WIRE_14GA]  (value not drawn)  (no BOM)
J8  ~14GA_WIRE  [WIRE_14GA]  (value not drawn)  (no BOM)
J9  ~14GA_WIRE  [WIRE_14GA]  (value not drawn)  (no BOM)
J10  ~14GA_WIRE  [WIRE_14GA]  (value not drawn)  (no BOM)
J11  JDT1512PA00Z  [JDT1512PA00Z]  (no BOM)
J12  JDT1512PA00Z  [JDT1512PA00Z]
J13  CPM5.08/6VE  [JCPM5086VE0Z]
J14  787834-2  [KUSBVX-BS1N]  (no BOM)
J15  DE-9S  [DSUBV9]  (no BOM)
J16  JDT1512PA00Z  [JDT1512PA00Z]
J17  JDT1512PA00Z  [JDT1512PA00Z]
J18  JTSW12011TSRAM  [JTSW12011TSRAM]
J19  JDT1506PA00Z  [JDT1506PA00Z - 2 holes]
JP1  RS/ERJ6GEYJ0R00VP  [R0805]
JP2  RS/ERJ6GEYJ0R00VP  [R0805]
JP3  RS/ERJ6GEYJ0R00VP  [R0805]
JP4  RS/ERJ6GEYJ0R00VP  [R0805]
L1  33uH 3A  [IND/DO5022]
M1  Mounting Hole 1/4" Screw  [MHole250]  (no BOM)
M2  Mounting Hole 1/4" Screw  [MHole250]  (no BOM)
M3  Mounting Hole 1/4" Screw  [MHole250]  (no BOM)
M4  Mounting Hole 1/4" Screw  [MHole250]  (no BOM)
M5  Mounting Hole 1/4" Screw  [MHole250]  (no BOM)
M6  Mounting Hole 1/4" Screw  [MHole250]  (no BOM)
Q1  QS/VNB14NV04Z  [D2PAK]
Q2  QS/VNB14NV04Z  [D2PAK]
Q3  QS/VNB14NV04Z  [D2PAK]
Q4  QS/VNB14NV04Z  [D2PAK]
Q5  QS/VNB14NV04Z  [D2PAK]
Q6  QS/VNB14NV04Z  [D2PAK]
Q7  QS/VNB14NV04Z  [D2PAK]
Q8  QS/VNB14NV04Z  [D2PAK]
Q9  QS/VNB14NV04Z  [D2PAK]
Q10  QS/VNB14NV04Z  [D2PAK]
Q11  QS/VNB14NV04Z  [D2PAK]
Q12  QS/VNB14NV04Z  [D2PAK]
Q13  QS/VNB14NV04Z  [D2PAK]
Q14  QS/VNB14NV04Z  [D2PAK]
Q15  QS/VNB14NV04Z  [D2PAK]
Q16  QS/VNB14NV04Z  [D2PAK]
Q17  QS/VNB14NV04Z  [D2PAK]
Q18  QS/VNB14NV04Z  [D2PAK]
Q19  QS/VNB14NV04Z  [D2PAK]
Q20  QS/VNB14NV04Z  [D2PAK]
Q21  QS/VNB14NV04Z  [D2PAK]
Q22  BCX70K  [SOT23]
Q23  BCX70K  [SOT23]
Q24  BCX70K  [SOT23]
Q25  BCX70K  [SOT23]
Q26  BCX70K  [SOT23]
Q27  BCX70K  [SOT23]
Q28  BCX70K  [SOT23]
Q29  BCX70K  [SOT23]
Q30  BCX70K  [SOT23]
Q31  BCX70K  [SOT23]
Q32  BCX70K  [SOT23]
Q33  BCX70K  [SOT23]
Q34  BCX70K  [SOT23]
Q35  BCX70K  [SOT23]
Q36  BCX70K  [SOT23]
Q37  BCX70K  [SOT23]
Q38  BCX70K  [SOT23]
Q39  BCX70K  [SOT23]
Q40  BCX70K  [SOT23]
Q41  BCX70K  [SOT23]
Q42  BCX70K  [SOT23]
Q43  BCX70K  [SOT23]
Q44  BCX70K  [SOT23]
Q45  BCX70K  [SOT23]
Q46  BCX70K  [SOT23]
Q47  BCX70K  [SOT23]
Q48  BCX70K  [SOT23]
Q49  BCX70K  [SOT23]
Q50  BCX70K  [SOT23]
Q51  BCX70K  [SOT23]
Q52  BCX70K  [SOT23]
Q53  BCX70K  [SOT23]
Q54  BCX70K  [SOT23]
Q55  BCX70K  [SOT23]
Q56  BCX70K  [SOT23]
Q57  BCX70K  [SOT23]
Q58  BCX70K  [SOT23]
Q59  BCX70K  [SOT23]
Q60  BCX70K  [SOT23]
Q61  BCX70K  [SOT23]
Q62  BCX70K  [SOT23]
Q63  BCX70K  [SOT23]
R1  RS/ERJ6ENF1003VP  [R0805]  (no BOM)
R2  RS/ERJ6ENF1003VP  [R0805]  (no BOM)
R3  RS/ERJ6ENF1002VP  [R0805]
R4  RS/ERJ6ENF1003VP  [R0805]  (no BOM)
R5  RS/ERJ8ENF1210VP  [R1206]  (no BOM)
R6  RS/ERJ6ENF2001VP  [R0805]
R7  RS/ERJ6ENF2001VP  [R0805]
R8  RS/ERJ6ENF2001VP  [R0805]
R9  RS/ERJ6ENF2001VP  [R0805]
R10  RS/ERJ6ENF2001VP  [R0805]
R11  RS/ERJ6ENF2001VP  [R0805]
R12  RS/ERJ6ENF2001VP  [R0805]
R13  RS/ERJ6ENF2001VP  [R0805]
R14  RS/ERJ6ENF2001VP  [R0805]
R15  RS/ERJ6ENF2001VP  [R0805]
R16  RS/ERJ6ENF1003VP  [R0805]  (no BOM)
R17  RS/ERJ6ENF1002VP  [R0805]
R18  RS/ERJ6ENF1001VP  [R0805]
R19  RS/ERJ6ENF1002VP  [R0805]
R20  RS/ERJ6ENF1003VP  [R0805]
R21  RS/ERJ6ENF1003VP  [R0805]
R22  RS/ERJ6ENF1003VP  [R0805]
R23  RS/ERJ6ENF1003VP  [R0805]
R24  RS/ERJ6ENF1003VP  [R0805]
R25  RS/ERJ6ENF1003VP  [R0805]
R26  RS/ERJ6ENF1003VP  [R0805]
R27  RS/ERJ6ENF1003VP  [R0805]
R28  RS/ERJ6ENF1002VP  [R0805]
R29  RS/ERJ6ENF5491VP  [R0805]
R30  RS/ERJ6ENF4750VP  [R0805]
R31  RS/ERJ6ENF1003VP  [R0805]  (no BOM)
R32  RS/ERJ6GEYJ0R00VP  [R0805]
R33  RS/ERJ6ENF2001VP  [R0805]
R34  RS/ERJ6ENF1003VP  [R0805]
R35  RS/ERJ6ENF2001VP  [R0805]
R36  RS/ERJ6ENF1003VP  [R0805]
R37  RS/ERJ6ENF2001VP  [R0805]
R38  RS/ERJ6ENF1003VP  [R0805]
R39  RS/ERJ6ENF2001VP  [R0805]
R40  RS/ERJ6ENF1003VP  [R0805]
R41  RS/ERJ6ENF2001VP  [R0805]
R42  RS/ERJ6ENF1003VP  [R0805]
R43  RS/ERJ6ENF2001VP  [R0805]
R44  RS/ERJ6ENF1003VP  [R0805]
R45  RS/ERJ6ENF2001VP  [R0805]
R46  RS/ERJ6ENF1003VP  [R0805]
R47  RS/ERJ6ENF2001VP  [R0805]
R48  RS/ERJ6ENF1003VP  [R0805]
R49  RS/ERJ6ENF2001VP  [R0805]
R50  RS/ERJ6ENF1003VP  [R0805]
R51  RS/ERJ6ENF2001VP  [R0805]
R52  RS/ERJ6ENF1003VP  [R0805]
R53  RS/ERJ6ENF3321VP  [R0805]
R54  RS/ERJ6ENF4752VP  [R0805]
R55  RS/ERJ6ENF1003VP  [R0805]
R56  RS/ERJ6ENF7501VP  [R0805]
R57  RS/ERJ6ENF2491VP  [R0805]
R58  RS/ERJ6ENF1003VP  [R0805]  (no BOM)
R59  RS/ERJ6ENF2002VP  [R0805]
R60  RS/ERJ6ENF1003VP  [R0805]
R61  RS/ERJ6ENF1003VP  [R0805]
R62  RS/ERJ6ENF2001VP  [R0805]
R63  RS/ERJ6ENF2001VP  [R0805]
R64  RS/ERJ6ENF2001VP  [R0805]
R65  RS/ERJ6ENF2001VP  [R0805]
R66  RS/ERJ6ENF2001VP  [R0805]
R67  33 Ohm 5 W  [RES30.6-25.5X9]
R68  RS/ERJ6ENF1003VP  [R0805]
R69  RS/ERJ6ENF2001VP  [R0805]
R70  RS/ERJ6ENF2001VP  [R0805]
R71  RS/ERJ6ENF2001VP  [R0805]
R72  RS/ERJ6ENF2001VP  [R0805]
R73  RS/ERJ6ENF2001VP  [R0805]
R74  RS/ERJ6ENF1003VP  [R0805]
R75  10K  [P3299W]
R76  RS/ERJ6ENF1003VP  [R0805]
R77  RS/ERJ6ENF1003VP  [R0805]
R78  RS/ERJ6ENF1003VP  [R0805]
R79  RS/ERJ6ENF1003VP  [R0805]
R80  RS/ERJ6ENF1003VP  [R0805]
R81  RS/ERJ6ENF1003VP  [R0805]
R82  RS/ERJ6ENF1002VP  [R0805]
R83  RS/ERJ6ENF2001VP  [R0805]
R84  RS/ERJ6ENF2001VP  [R0805]
R85  RS/ERJ6ENF1003VP  [R0805]
R86  RS/ERJ6ENF2001VP  [R0805]
R87  RS/ERJ6ENF1003VP  [R0805]
R88  RS/ERJ6ENF2001VP  [R0805]
R89  RS/ERJ6ENF1003VP  [R0805]
R90  RS/ERJ6ENF2001VP  [R0805]
R91  RS/ERJ6ENF1003VP  [R0805]
R92  RS/ERJ6ENF2001VP  [R0805]
R93  RS/ERJ6ENF1003VP  [R0805]
R94  RS/ERJ6ENF2001VP  [R0805]
R95  RS/ERJ6ENF1003VP  [R0805]
R96  RS/ERJ6ENF2001VP  [R0805]
R97  RS/ERJ6ENF1003VP  [R0805]
R98  RS/ERJ6ENF2001VP  [R0805]
R99  RS/ERJ6ENF1003VP  [R0805]
R100  RS/ERJ6ENF2001VP  [R0805]
R101  RS/ERJ6ENF1003VP  [R0805]
R102  RS/ERJ6ENF2001VP  [R0805]
R103  RS/ERJ6ENF1003VP  [R0805]
R104  RS/ERJ6ENF1003VP  [R0805]
R105  RS/ERJ6ENF4991VP  [R0805]
R106  RS/ERJ6ENF4991VP  [R0805]
R107  RS/ERJ6ENF4991VP  [R0805]
R108  RS/ERJ6ENF4991VP  [R0805]
R109  RS/ERJ6ENF4991VP  [R0805]
R110  RS/ERJ6ENF4991VP  [R0805]
R111  RS/ERJ8ENF1650VP  [R1206]
R112  RS/ERJ8ENF1650VP  [R1206]
R113  RS/ERJ8ENF1650VP  [R1206]
R114  RS/ERJ8ENF45R3VP  [R1206]
R115  RS/ERJ8ENF45R3VP  [R1206]
R116  RS/ERJ8ENF45R3VP  [R1206]
R117  RS/ERJ8ENF1650VP  [R1206]
R118  RS/ERJ8ENF1650VP  [R1206]
R119  RS/ERJ8ENF1650VP  [R1206]
R120  RS/ERJ8ENF45R3VP  [R1206]
R121  RS/ERJ8ENF45R3VP  [R1206]
R122  RS/ERJ8ENF45R3VP  [R1206]
R123  RS/ERJ6ENF4991VP  [R0805]
R124  RS/ERJ6ENF4991VP  [R0805]
R125  RS/ERJ6ENF4991VP  [R0805]
R126  RS/ERJ6ENF4991VP  [R0805]
R127  RS/ERJ6ENF4991VP  [R0805]
R128  RS/ERJ6ENF4991VP  [R0805]
R129  RS/ERJ8ENF1650VP  [R1206]
R130  RS/ERJ8ENF1650VP  [R1206]
R131  RS/ERJ8ENF1650VP  [R1206]
R132  RS/ERJ8ENF45R3VP  [R1206]
R133  RS/ERJ8ENF45R3VP  [R1206]
R134  RS/ERJ8ENF45R3VP  [R1206]
R135  RS/ERJ8ENF1650VP  [R1206]
R136  RS/ERJ8ENF1650VP  [R1206]
R137  RS/ERJ8ENF1650VP  [R1206]
R138  RS/ERJ8ENF45R3VP  [R1206]
R139  RS/ERJ8ENF45R3VP  [R1206]
R140  RS/ERJ8ENF45R3VP  [R1206]
R141  RS/ERJ6ENF4991VP  [R0805]
R142  RS/ERJ6ENF4991VP  [R0805]
R143  RS/ERJ6ENF4991VP  [R0805]
R144  RS/ERJ6ENF4991VP  [R0805]
R145  RS/ERJ6ENF4991VP  [R0805]
R146  RS/ERJ6ENF4991VP  [R0805]
R147  RS/ERJ8ENF1650VP  [R1206]
R148  RS/ERJ8ENF1650VP  [R1206]
R149  RS/ERJ8ENF1650VP  [R1206]
R150  RS/ERJ8ENF45R3VP  [R1206]
R151  RS/ERJ8ENF45R3VP  [R1206]
R152  RS/ERJ8ENF45R3VP  [R1206]
R153  RS/ERJ8ENF1650VP  [R1206]
R154  RS/ERJ8ENF1650VP  [R1206]
R155  RS/ERJ8ENF1650VP  [R1206]
R156  RS/ERJ8ENF45R3VP  [R1206]
R157  RS/ERJ8ENF45R3VP  [R1206]
R158  RS/ERJ8ENF45R3VP  [R1206]
R159  RS/ERJ6ENF4991VP  [R0805]
R160  RS/ERJ6ENF4991VP  [R0805]
R161  RS/ERJ6ENF4991VP  [R0805]
R162  RS/ERJ6ENF4991VP  [R0805]
R163  RS/ERJ6ENF4991VP  [R0805]
R164  RS/ERJ6ENF4991VP  [R0805]
R165  RS/ERJ8ENF1650VP  [R1206]
R166  RS/ERJ8ENF1650VP  [R1206]
R167  RS/ERJ8ENF1650VP  [R1206]
R168  RS/ERJ8ENF45R3VP  [R1206]
R169  RS/ERJ8ENF45R3VP  [R1206]
R170  RS/ERJ8ENF45R3VP  [R1206]
R171  RS/ERJ8ENF1650VP  [R1206]
R172  RS/ERJ8ENF1650VP  [R1206]
R173  RS/ERJ8ENF1650VP  [R1206]
R174  RS/ERJ8ENF45R3VP  [R1206]
R175  RS/ERJ8ENF45R3VP  [R1206]
R176  RS/ERJ8ENF45R3VP  [R1206]
R177  RS/ERJ6ENF4991VP  [R0805]
R178  RS/ERJ6ENF4991VP  [R0805]
R179  RS/ERJ6ENF4991VP  [R0805]
R180  RS/ERJ6ENF4991VP  [R0805]
R181  RS/ERJ6ENF4991VP  [R0805]
R182  RS/ERJ6ENF4991VP  [R0805]
R183  RS/ERJ8ENF1650VP  [R1206]
R184  RS/ERJ8ENF1650VP  [R1206]
R185  RS/ERJ8ENF1650VP  [R1206]
R186  RS/ERJ8ENF45R3VP  [R1206]
R187  RS/ERJ8ENF45R3VP  [R1206]
R188  RS/ERJ8ENF45R3VP  [R1206]
R189  RS/ERJ8ENF1650VP  [R1206]
R190  RS/ERJ8ENF1650VP  [R1206]
R191  RS/ERJ8ENF1650VP  [R1206]
R192  RS/ERJ8ENF45R3VP  [R1206]
R193  RS/ERJ8ENF45R3VP  [R1206]
R194  RS/ERJ8ENF45R3VP  [R1206]
R195  RS/ERJ6ENF4991VP  [R0805]
R196  RS/ERJ6ENF4991VP  [R0805]
R197  RS/ERJ6ENF4991VP  [R0805]
R198  RS/ERJ6ENF4991VP  [R0805]
R199  RS/ERJ6ENF4991VP  [R0805]
R200  RS/ERJ6ENF4991VP  [R0805]
R201  RS/ERJ8ENF1650VP  [R1206]
R202  RS/ERJ8ENF1650VP  [R1206]
R203  RS/ERJ8ENF1650VP  [R1206]
R204  RS/ERJ8ENF45R3VP  [R1206]
R205  RS/ERJ8ENF45R3VP  [R1206]
R206  RS/ERJ8ENF45R3VP  [R1206]
R207  RS/ERJ8ENF1650VP  [R1206]
R208  RS/ERJ8ENF1650VP  [R1206]
R209  RS/ERJ8ENF1650VP  [R1206]
R210  RS/ERJ8ENF45R3VP  [R1206]
R211  RS/ERJ8ENF45R3VP  [R1206]
R212  RS/ERJ8ENF45R3VP  [R1206]
R213  RS/ERJ6ENF4991VP  [R0805]
R214  RS/ERJ6ENF4991VP  [R0805]
R215  RS/ERJ6ENF4991VP  [R0805]
R216  RS/ERJ6ENF4991VP  [R0805]
R217  RS/ERJ6ENF4991VP  [R0805]
R218  RS/ERJ6ENF4991VP  [R0805]
R219  RS/ERJ8ENF1650VP  [R1206]
R220  RS/ERJ8ENF1650VP  [R1206]
R221  RS/ERJ8ENF1650VP  [R1206]
R222  RS/ERJ8ENF45R3VP  [R1206]
R223  RS/ERJ8ENF45R3VP  [R1206]
R224  RS/ERJ8ENF45R3VP  [R1206]
R225  RS/ERJ8ENF1650VP  [R1206]
R226  RS/ERJ8ENF1650VP  [R1206]
R227  RS/ERJ8ENF1650VP  [R1206]
R228  RS/ERJ8ENF45R3VP  [R1206]
R229  RS/ERJ8ENF45R3VP  [R1206]
R230  RS/ERJ8ENF45R3VP  [R1206]
R231  RS/ERJ6ENF1003VP  [R0805]
R232  RS/ERJ6ENF1001VP  [R0805]
R233  RS/ERJ6ENF1001VP  [R0805]
R234  RS/ERJ6ENF1001VP  [R0805]
U1  IS/SN74HC573DWZ  [SOIC300-20]
U2  M25P64-VMF6G  [so16w]  (no BOM)
U3  dsPIC30F6014A-30I/PT  [TQFP-80]
U4  IS/CS4344CZZZ  [TSSOP\10]
U5  CAN Transceiver  [SOIC 8]
U6  M25P64-VMF6G  [SO16W]  (no BOM)
U7  IS/LM2676SADJN  [TO263\7]
U8  LP2950CDT-3.3  [D-PAK / TO-252AA]
U9  M25P64-VMF6G  [so16w]  (no BOM)
U10  IS/SN74HC541DWZ  [SOIC300-20]
U11  LM4861M  [soic 8]
U12  LP2950CDT-5.0  [D-PAK / TO-252AA]
U13  M25P64-VMF6G  [so16w]  (no BOM)
U14  IS/SN74HC573DWZ  [SOIC300-20]
U15  IS/MAX3221IDBRT  [SSOP16]  (no BOM)
U16  CP2102-GM  [QFN28]  (no BOM)
U17  Voltage Converter  [SOIC 8]
U18  IS/SN74HC541DWZ  [SOIC300-20]
U19  IS/SN74HC573DWZ  [SOIC300-20]
U20  IS/SN74HC573DWZ  [SOIC300-20]
U21  IS/SN74HC573DWZ  [SOIC300-20]
U22  IS/SN74HC573DWZ  [SOIC300-20]
U23  IS/SN74HC573DWZ  [SOIC300-20]
U24  IS/SN74HC573DWZ  [SOIC300-20]
U25  IS/SN74HC138DZ  [SOIC 16]
U26  I#S/DS1306EN+Z  [TSSOP-20]
Y1  12.288MHz  [XTSL\CSM-7]
Y2  32.768KHz  [ZS/MC306]

### Ports
5V, 5V_DISABLE, 8V, AUDIO_SHUTDOWN, CAN_~{HS}/STBY, CANRX, CANTX, CLK0, CLK0 (in), CLK1, CLK1 (in), CLK2, CLK2 (in), CLK3, CLK3 (in), CLK4, CLK4 (in), CLK5, CLK5 (in), CLK6, CLK6 (in), CLK7, CLK7 (in), COFS, CSCK, CSDO, D0, D0 (in), D1, D1 (in), D2, D2 (in), D3, D3 (in), D4, D4 (in), D5, D5 (in), D6, D6 (in), D7, D7 (in), FORCEON, LAMP0, LAMP1, LAMP2, LAMP3, LAMP4, LAMP5, LAMP10, LAMP11, LAMP12, LAMP13, LAMP20, LCD_CS1, LCD_CS2, LCD_D/I, LCD_E, LCD_R/W, LCD_RESET, LED_CLK_A, LED_CLK_B, LED_CLK_C, LED_CLK_EN, LED_OE, LIGHT_SENSOR NEG, LIGHT_SENSOR POS, MCLK, MCLR, MEM_~{W}, OPTION0, OPTION1, OPTION2, OPTION3, PGC, PGD, RTC_CE, RXD, RXD2, SCK, SCK2, SDI, SDI2, SDO, SDO2, SWITCH8, SWITCH9, SWITCH16, SWITCH17, SWITCH18, SWITCH19, SWITCHES0-7, SWITCHES8-15, TXD, TXD2, USB_RST, V_IN, VBAT (in), VBATT, VIN_SENSE_ANALOG, ~{FORCEOFF}, ~{LED_OE} (in), ~{MEM0}, ~{MEM1}, ~{MEM2}, ~{MEM3}, ~{RS232_INVALID}

### Nets
+3.3 VDC: C1.1 C2.1 C3.1 C4.1 C6.1 C10.1 C14.1 C16.1 C18.1 C23.1 C25.1 C30.1 C33.1 C36.1 C37.1 C39.1 C46.1 C47.1 C48.1 C49.1 C50.1 C51.1 C52.1 C53.1 C54.1 J13.2 R1.1 R2.1 R3.2 R4.2 R16.2 R19.1 R31.2 R54.2 R55.1 R58.2 R60.2 R61.2 R68.2 R74.2 R82.2 R104.1 R231.1 R232.1 U1.20(VCC) U2.2(VCC) U3.12(VDD) U3.25(AVDD) U3.32(VDD) U3.48(VDD) U3.71(VDD) U4.9(VA) U5.3(VCC) U6.2(VCC) U8.3(OUT) U9.2(VCC) U10.20(VCC) U13.2(VCC) U14.20(VCC) U15.15(VCC) U16.6(VDD) U16.7(REGIN) U18.20(VCC) U19.20(VCC) U20.20(VCC) U21.20(VCC) U22.20(VCC) U23.20(VCC) U24.20(VCC) U25.6(OE1) U25.16(VCC) U26.11(SERMODE) U26.17(VCCIF) U26.20(VCC1)  [also labelled VCC]
+5 VDC: C29.1 C32.1 C42.1 C43.1 C45.1 J18.2 U11.6(VDD) U12.3(OUT) U17.8(V+) ; port 5V
+8 VDC: C20.1 C24.1 C28.1 DS1.1(A) DS3.1(A) DS5.1(A) DS7.1(A) DS9.1(A) DS11.1(A) DS13.1(A) DS15.1(A) DS17.1(A) DS19.1(A) DS21.1(A) DS23.1(A) DS25.1(A) DS27.1(A) DS29.1(A) DS31.1(A) DS33.1(A) DS35.1(A) DS37.1(A) DS39.1(A) DS41.1(A) DS43.1(A) DS45.1(A) DS47.1(A) DS49.1(A) DS51.1(A) DS53.1(A) DS55.1(A) DS57.1(A) DS59.1(A) DS61.1(A) DS63.1(A) DS65.1(A) DS67.1(A) DS69.1(A) DS71.1(A) DS73.1(A) DS75.1(A) DS77.1(A) DS79.1(A) DS81.1(A) DS83.1(A) DS85.1(A) DS87.1(A) DS89.1(A) DS91.1(A) DS93.1(A) DS95.1(A) DS97.1(A) DS99.1(A) DS101.1(A) DS103.1(A) DS105.1(A) DS107.1(A) DS109.1(A) DS111.1(A) DS113.1(A) DS115.1(A) DS117.1(A) DS119.1(A) DS121.1(A) DS123.1(A) DS125.1(A) DS127.1(A) DS129.1(A) DS131.1(A) DS133.1(A) DS135.1(A) DS137.1(A) DS139.1(A) DS141.1(A) DS143.1(A) DS145.1(A) DS147.1(A) DS149.1(A) DS151.1(A) DS153.1(A) DS155.1(A) DS157.1(A) DS159.1(A) DS161.1(A) DS163.1(A) DS165.1(A) DS167.1(A) L1.2 R29.2 U12.1(IN) ; port 8V
GND: C1.2 C2.2 C3.2 C4.2 C5.2 C6.2 C7.2 C8.2 C9.2 C10.2 C11.2 C12.2 C14.2 C16.2 C17.2 C18.2 C19.2 C20.2 C22.2 C23.2 C24.2 C25.2 C26.2 C27.2 C28.2 C29.2 C30.2 C31.2 C32.2 C33.2 C36.2 C37.2 C38.2 C39.2 C40.2 C41.1 C42.2 C43.2 C45.2 C46.2 C47.2 C48.2 C49.2 C50.2 C51.2 C52.2 C53.2 C54.2 D2.3(A) D3.1(A) D4.1(A) D5.1(A) D6.1(A) D7.1(A) D8.1(A) D9.1(A) D10.1(A) D11.1(A) D12.1(A) D13.1(A) D14.1(A) D15.1(A) D16.1(A) D17.1(A) D18.1(A) D19.1(A) D20.1(A) D21.1(A) D22.1(A) D23.1(A) D24.1(A) D25.1(A) J1.1(14GA_WIRE) J5.1(14GA_WIRE) J13.3 J14.4(GND) J15.5 J15.10(MH1) J15.11(MH2) J18.1 J19.3 JP1.2 JP2.2 JP3.2 JP4.2 Q1.3(S) Q2.3(S) Q3.3(S) Q4.3(S) Q5.3(S) Q6.3(S) Q7.3(S) Q8.3(S) Q9.3(S) Q10.3(S) Q11.3(S) Q12.3(S) Q13.3(S) Q14.3(S) Q15.3(S) Q16.3(S) Q17.3(S) Q18.3(S) Q19.3(S) Q20.3(S) Q21.3(S) Q22.2(E) Q23.2(E) Q24.2(E) Q25.2(E) Q26.2(E) Q27.2(E) Q28.2(E) Q29.2(E) Q30.2(E) Q31.2(E) Q32.2(E) Q33.2(E) Q34.2(E) Q35.2(E) Q36.2(E) Q37.2(E) Q38.2(E) Q39.2(E) Q40.2(E) Q41.2(E) Q42.2(E) Q43.2(E) Q44.2(E) Q45.2(E) Q46.2(E) Q47.2(E) Q48.2(E) Q49.2(E) Q50.2(E) Q51.2(E) Q52.2(E) Q53.2(E) Q54.2(E) Q55.2(E) Q56.2(E) Q57.2(E) Q58.2(E) Q59.2(E) Q60.2(E) Q61.2(E) Q62.2(E) Q63.2(E) R18.1 R28.1 R34.2 R36.2 R38.2 R40.2 R42.2 R44.2 R46.2 R48.2 R50.2 R52.2 R57.1 R75.1(CCW) R85.2 R87.2 R89.2 R91.2 R93.2 R95.2 R97.2 R99.2 R101.2 R103.2 R234.1 U1.10(GND) U2.10(VSS) U3.11(VSS) U3.26(AVSS) U3.31(VSS) U3.51(VSS) U3.70(VSS) U3.79(CSDI/RG12) U4.8(GND) U5.2(GND) U6.10(VSS) U7.4(GND) U8.2(GND) U9.10(VSS) U10.10(GND) U11.7(GND) U12.2(GND) U13.10(VSS) U14.10(GND) U15.1(~{EN}) U15.14(GND) U16.3(GND) U17.3(GND) U18.10(GND) U19.10(GND) U20.10(GND) U21.10(GND) U22.10(GND) U23.10(GND) U24.10(GND) U25.5(~{OE}2B) U25.8(GND) U26.1(VCC2) U26.10(GND)
Vbat: D1.A J2.1(14GA_WIRE) J6.1(14GA_WIRE) J11.6 J11.7 J12.6 J12.7 J16.6 J16.7 J17.6 J17.7 ; port VBATT
Vin: C8.1 C9.1 C11.1 C17.1 D1.K R56.2 R67.1 U7.2(IN) U8.1(IN) ; port V_IN
5V_DISABLE: R17.1 U3.35(AN14/RB14) ; port 5V_DISABLE
AUDIO_SHUTDOWN: R54.1 U3.46(SDA/RG3) U11.1(SD) ; port AUDIO_SHUTDOWN
CAN_~{HS}/STBY: U3.34(AN13/RB13) U5.8(~{HS}/STBY) ; port CAN_~{HS}/STBY
CANRX: U3.73(C1TX/RF1) U5.1(D) ; port CANTX
CANTX: U3.72(C1RX/RF0) U5.4(R) ; port CANRX
COFS: U3.1(COFS/RG15) U4.3(LRCLK) ; port COFS
CSCK: U3.78(CSCK/RG14) U4.2(~{DEM}/SCLK) ; port CSCK
CSDO: U3.80(CSDO/RG13) U4.1(SDIN) ; port CSDO
D0: R20.1 U1.2(D1) U3.58(EMUC2/OC1/RD0) U10.18(Y1) U14.2(D1) U18.18(Y1) U19.2(D1) U20.2(D1) U21.2(D1) U22.2(D1) U23.2(D1) U24.2(D1) ; port D0
D1: R21.1 U1.3(D2) U3.61(EMUD2/OC2/RD1) U10.17(Y2) U14.3(D2) U18.17(Y2) U19.3(D2) U20.3(D2) U21.3(D2) U22.3(D2) U23.3(D2) U24.3(D2) ; port D1
D2: R22.1 U1.4(D3) U3.62(OC3/RD2) U10.16(Y3) U14.4(D3) U18.16(Y3) U19.4(D3) U20.4(D3) U21.4(D3) U22.4(D3) U23.4(D3) U24.4(D3) ; port D2
D3: R23.1 U1.5(D4) U3.63(OC4/RD3) U10.15(Y4) U14.5(D4) U18.15(Y4) U19.5(D4) U20.5(D4) U21.5(D4) U22.5(D4) U23.5(D4) U24.5(D4) ; port D3
D4: R24.1 U1.6(D5) U3.66(OC5/CN13/RD4) U10.14(Y5) U14.6(D5) U18.14(Y5) U19.6(D5) U20.6(D5) U21.6(D5) U22.6(D5) U23.6(D5) U24.6(D5) ; port D4
D5: R25.1 U1.7(D6) U3.67(OC6/CN14/RD5) U10.13(Y6) U14.7(D6) U18.13(Y6) U19.7(D6) U20.7(D6) U21.7(D6) U22.7(D6) U23.7(D6) U24.7(D6) ; port D5
D6: R26.1 U1.8(D7) U3.68(OC7/CN15/RD6) U10.12(Y7) U14.8(D7) U18.12(Y7) U19.8(D7) U20.8(D7) U21.8(D7) U22.8(D7) U23.8(D7) U24.8(D7) ; port D6
D7: R27.1 U1.9(D8) U3.69(OC8/CN16/RD7) U10.11(Y8) U14.9(D8) U18.11(Y8) U19.9(D8) U20.9(D8) U21.9(D8) U22.9(D8) U23.9(D8) U24.9(D8) ; port D7
~{FORCEOFF}: U3.28(AN9/RB9) U15.16(~{FORCEOFF}) ; port ~{FORCEOFF}
FORCEON: U3.27(AN8/RB8) U15.12(FORCEON) ; port FORCEON
LAMP0: R6.1 U19.12(Q8) ; port LAMP0
LAMP1: R7.1 U20.12(Q8) ; port LAMP1
LAMP2: R8.1 U21.12(Q8) ; port LAMP2
LAMP3: R9.1 U22.12(Q8) ; port LAMP3
LAMP4: R10.1 U23.12(Q8) ; port LAMP4
LAMP5: R11.1 U24.12(Q8) ; port LAMP5
LAMP6: R12.1 U1.19(Q1)
LAMP7: R13.1 U1.18(Q2)
LAMP8: R14.1 U1.17(Q3)
LAMP9: R15.1 U1.16(Q4)
LAMP10: R62.1 U1.15(Q5) ; port LAMP10
LAMP11: R63.1 U1.14(Q6) ; port LAMP11
LAMP12: R64.1 U1.13(Q7) ; port LAMP12
LAMP13: R65.1 U1.12(Q8) ; port LAMP13
LAMP14: R66.1 U14.19(Q1)
LAMP15: R69.1 U14.18(Q2)
LAMP16: R70.1 U14.17(Q3)
LAMP17: R71.1 U14.16(Q4)
LAMP18: R72.1 U14.15(Q5)
LAMP19: R73.1 U14.14(Q6)
LAMP20: R83.1 U14.13(Q7) ; port LAMP20
LCD_CS1: R79.1 U3.64(IC5/RD12) ; port LCD_CS1
LCD_CS2: R80.1 U3.65(IC6/CN19/RD13) ; port LCD_CS2
LCD_D/I: R76.1 U3.55(IC2/RD9) ; port LCD_D/I
LCD_E: R78.1 U3.56(IC3/RD10) ; port LCD_E
LCD_R/W: R77.1 U3.54(IC1/RD8) ; port LCD_R/W
LCD_RESET: R81.1 U3.57(IC4/RD11) ; port LCD_RESET
LED_CLK_A: U3.21(AN6/OCFA/RB6) U25.1(A) ; port LED_CLK_A
LED_CLK_B: U3.22(AN7/RB7) U25.2(B) ; port LED_CLK_B
LED_CLK_C: U3.33(AN12/RB12) U25.3(C) ; port LED_CLK_C
LED_CLK_EN: R231.2 U3.37(IC7/CN20/RD14) U25.4(~{OE}2A) ; port LED_CLK_EN
LED_OE: R19.2 U1.1(~{OE}) U3.38(IC8/CN21/RD15) U14.1(~{OE}) U19.1(~{OE}) U20.1(~{OE}) U21.1(~{OE}) U22.1(~{OE}) U23.1(~{OE}) U24.1(~{OE}) ; port ~{LED_OE}, port LED_OE
MEM0: R4.1 U2.7(~{S}) U3.13(INT1/RA12) ; port ~{MEM0}
MEM1: R16.1 U3.14(INT2/RA13) U6.7(~{S}) ; port ~{MEM1}
MEM2: R31.1 U3.52(INT3/RA14) U9.7(~{S}) ; port ~{MEM2}
MEM3: R58.1 U3.53(INT4/RA15) U13.7(~{S}) ; port ~{MEM3}
MEM_SCK: U2.16(CLK) U3.45(EMUC3/SCK1/INT0/RF6) U6.16(CLK) U9.16(CLK) U13.16(CLK) ; port SCK
MEM_SDI: U2.8(Q) U3.44(SDI1/RF7) U6.8(Q) U9.8(Q) U13.8(Q) ; port SDI
MEM_SDO: U2.15(D) U3.43(EMUD3/SDO1/RF8) U6.15(D) U9.15(D) U13.15(D) ; port SDO
MEM_~{W}: R1.2 U2.9(~{W}/VPP) U3.36(AN15/OCFB/CN12/RB15) U6.9(~{W}/VPP) U9.9(~{W}/VPP) U13.9(~{W}/VPP) ; port MEM_~{W}
OPT0: JP4.1 R74.1 U3.76(CN22/RA6) ; port OPTION0
OPT1: JP3.1 R68.1 U3.77(CN23/RA7) ; port OPTION1
OPT2: JP2.1 R61.1 U3.23(VREF-/RA9) ; port OPTION2
OPT3: JP1.1 R60.1 U3.24(VREF+/RA10) ; port OPTION3
PGC: J13.5 U3.19(PGC/EMUC/AN1/CN3/RB1) ; port PGC
PGD: J13.4 U3.20(PGD/EMUD/AN0/CN2/RB0) ; port PGD
~{RS232_INVALID}: U3.15(AN5/IC8/CN7/RB5) U15.10(~{INVALID}) ; port ~{RS232_INVALID}
RTC_CE: U3.10(~{SS2}/CN11/RG9) U26.12(CE) ; port RTC_CE
RTC_SCK: U3.6(SCK2/CN8/RG6) U26.14(SCLK) ; port SCK2
RTC_SDI: U3.7(SDI2/CN9/RG7) U26.16(SDO) ; port SDI2
RTC_SDO: U3.8(SDO2/CN10/RG8) U26.15(SDI) ; port SDO2
RXD_RS232: U3.42(U1RX/RF2) U15.9(R1OUT) ; port RXD
RXD_USB: U3.39(U2RX/CN17/RF4) U16.26(TXD) ; port RXD2
SWITCH0: D3.2(K) R33.1 R34.1 U10.2(A1)
SWITCH1: D4.2(K) R35.1 R36.1 U10.3(A2)
SWITCH2: D5.2(K) R37.1 R38.1 U10.4(A3)
SWITCH3: D25.2(K) R39.1 R40.1 U10.5(A4)
SWITCH4: D8.2(K) R41.1 R42.1 U10.6(A5)
SWITCH5: D9.2(K) R43.1 R44.1 U10.7(A6)
SWITCH6: D10.2(K) R45.1 R46.1 U10.8(A7)
SWITCH7: D11.2(K) R47.1 R48.1 U10.9(A8)
SWITCH8: D6.2(K) R49.1 R50.1 U18.2(A1) ; port SWITCH8
SWITCH9: D7.2(K) R51.1 R52.1 U18.3(A2) ; port SWITCH9
SWITCH10: D15.2(K) R84.1 R85.1 U18.4(A3)
SWITCH11: D16.2(K) R86.1 R87.1 U18.5(A4)
SWITCH12: D17.2(K) R88.1 R89.1 U18.6(A5)
SWITCH13: D18.2(K) R90.1 R91.1 U18.7(A6)
SWITCH14: D19.2(K) R92.1 R93.1 U18.8(A7)
SWITCH15: D20.2(K) R94.1 R95.1 U18.9(A8)
SWITCH16: D21.2(K) R96.1 R97.1 U3.2(T2CK/RC1) ; port SWITCH16
SWITCH17: D22.2(K) R98.1 R99.1 U3.3(T3CK/RC2) ; port SWITCH17
SWITCH18: D23.2(K) R100.1 R101.1 U3.59(EMUD1/SOSCI/CN1/RC13) ; port SWITCH18
SWITCH19: D24.2(K) R102.1 R103.1 U3.60(EMUC1/SOSCO/T1CK/CN0/RC14) ; port SWITCH19
SWITCHES0-7: R55.2 U3.74(C2TX/RG1) U10.1(~{OE}1) U10.19(~{OE}2) ; port SWITCHES0-7
SWITCHES8-15: R104.2 U3.47(SCL/RG2) U18.1(~{OE}1) U18.19(~{OE}2) ; port SWITCHES8-15
TXD_RS233: U3.41(U1TX/RF3) U15.11(T1IN) ; port TXD
TXD_USB: U3.40(U2TX/CN18/RF5) U16.25(RXD) ; port TXD2
USB_RST: R82.1 U3.75(C2RX/RG0) U16.9(~{RST}) ; port USB_RST
VIN_SENSE_ANALOG: C31.1 R56.1 R57.2 U3.18(AN2/~{SS1}/LVDIN/CN4/RB2) ; port VIN_SENSE_ANALOG
NetC5_1: C5.1 C7.1 U4.5(VQ)
NetC12_1: C12.1 U4.6(FILT+)
NetC13_1: C13.1 U4.10(AOUTR)
NetC13_2: C13.2 R28.2 R30.1
NetC15_1: C15.1 U7.3(CBOOST)
NetC15_2: C15.2 D2.2(K) L1.1 U7.1(OUT)
NetC19_1: C19.1 C21.1 R30.2
NetC21_2: C21.2 R53.1
NetC22_1: C22.1 R32.2 Y1.2(OSC2)
NetC26_1: C26.1 U3.49(OSC1/CLKIN) Y1.1(OSC1)
NetC27_1: C27.1 U11.2(BYP) U11.3(IN+)
NetC34_1: C34.1 U15.2(C1+)
NetC34_2: C34.2 U15.4(C1-)
NetC35_1: C35.1 U15.5(C2+)
NetC35_2: C35.2 U15.6(C2-)
NetC38_1: C38.1 U15.3(V+)
NetC40_1: C40.1 U15.7(V-)
NetC41_2: C41.2 R75.3(CW) U17.5(VOUT)
NetC44_1: C44.1 U17.2(CAP+)
NetC44_2: C44.2 U17.4(CAP-)
NetD12_3: D12.3(K) J14.1(VBUS) U16.8(VBUS)
NetD13_3: D13.3(K) J14.2(D-) U16.5(D-)
NetD14_3: D14.3(K) J14.3(D+) U16.4(D+)
NetDS1_2: DS1.2(K) DS2.1(A)
NetDS2_2: DS2.2(K) R111.2
NetDS3_2: DS3.2(K) DS4.1(A)
NetDS4_2: DS4.2(K) R112.2
NetDS5_2: DS5.2(K) DS6.1(A)
NetDS6_2: DS6.2(K) R113.2
NetDS7_2: DS7.2(K) DS8.1(A)
NetDS8_2: DS8.2(K) R114.2
NetDS9_2: DS9.2(K) DS10.1(A)
NetDS10_2: DS10.2(K) R115.2
NetDS11_2: DS11.2(K) DS12.1(A)
NetDS12_2: DS12.2(K) R116.2
NetDS13_2: DS13.2(K) DS14.1(A)
NetDS14_2: DS14.2(K) R117.2
NetDS15_2: DS15.2(K) DS16.1(A)
NetDS16_2: DS16.2(K) R118.2
NetDS17_2: DS17.2(K) DS18.1(A)
NetDS18_2: DS18.2(K) R119.2
NetDS19_2: DS19.2(K) DS20.1(A)
NetDS20_2: DS20.2(K) R120.2
NetDS21_2: DS21.2(K) DS22.1(A)
NetDS22_2: DS22.2(K) R121.2
NetDS23_2: DS23.2(K) DS24.1(A)
NetDS24_2: DS24.2(K) R122.2
NetDS25_2: DS25.2(K) DS26.1(A)
NetDS26_2: DS26.2(K) R129.2
NetDS27_2: DS27.2(K) DS28.1(A)
NetDS28_2: DS28.2(K) R130.2
NetDS29_2: DS29.2(K) DS30.1(A)
NetDS30_2: DS30.2(K) R131.2
NetDS31_2: DS31.2(K) DS32.1(A)
NetDS32_2: DS32.2(K) R132.2
NetDS33_2: DS33.2(K) DS34.1(A)
NetDS34_2: DS34.2(K) R133.2
NetDS35_2: DS35.2(K) DS36.1(A)
NetDS36_2: DS36.2(K) R134.2
NetDS37_2: DS37.2(K) DS38.1(A)
NetDS38_2: DS38.2(K) R135.2
NetDS39_2: DS39.2(K) DS40.1(A)
NetDS40_2: DS40.2(K) R136.2
NetDS41_2: DS41.2(K) DS42.1(A)
NetDS42_2: DS42.2(K) R137.2
NetDS43_2: DS43.2(K) DS44.1(A)
NetDS44_2: DS44.2(K) R138.2
NetDS45_2: DS45.2(K) DS46.1(A)
NetDS46_2: DS46.2(K) R139.2
NetDS47_2: DS47.2(K) DS48.1(A)
NetDS48_2: DS48.2(K) R140.2
NetDS49_2: DS49.2(K) DS50.1(A)
NetDS50_2: DS50.2(K) R147.2
NetDS51_2: DS51.2(K) DS52.1(A)
NetDS52_2: DS52.2(K) R148.2
NetDS53_2: DS53.2(K) DS54.1(A)
NetDS54_2: DS54.2(K) R149.2
NetDS55_2: DS55.2(K) DS56.1(A)
NetDS56_2: DS56.2(K) R150.2
NetDS57_2: DS57.2(K) DS58.1(A)
NetDS58_2: DS58.2(K) R151.2
NetDS59_2: DS59.2(K) DS60.1(A)
NetDS60_2: DS60.2(K) R152.2
NetDS61_2: DS61.2(K) DS62.1(A)
NetDS62_2: DS62.2(K) R153.2
NetDS63_2: DS63.2(K) DS64.1(A)
NetDS64_2: DS64.2(K) R154.2
NetDS65_2: DS65.2(K) DS66.1(A)
NetDS66_2: DS66.2(K) R155.2
NetDS67_2: DS67.2(K) DS68.1(A)
NetDS68_2: DS68.2(K) R156.2
NetDS69_2: DS69.2(K) DS70.1(A)
NetDS70_2: DS70.2(K) R157.2
NetDS71_2: DS71.2(K) DS72.1(A)
NetDS72_2: DS72.2(K) R158.2
NetDS73_2: DS73.2(K) DS74.1(A)
NetDS74_2: DS74.2(K) R165.2
NetDS75_2: DS75.2(K) DS76.1(A)
NetDS76_2: DS76.2(K) R166.2
NetDS77_2: DS77.2(K) DS78.1(A)
NetDS78_2: DS78.2(K) R167.2
NetDS79_2: DS79.2(K) DS80.1(A)
NetDS80_2: DS80.2(K) R168.2
NetDS81_2: DS81.2(K) DS82.1(A)
NetDS82_2: DS82.2(K) R169.2
NetDS83_2: DS83.2(K) DS84.1(A)
NetDS84_2: DS84.2(K) R170.2
NetDS85_2: DS85.2(K) DS86.1(A)
NetDS86_2: DS86.2(K) R171.2
NetDS87_2: DS87.2(K) DS88.1(A)
NetDS88_2: DS88.2(K) R172.2
NetDS89_2: DS89.2(K) DS90.1(A)
NetDS90_2: DS90.2(K) R173.2
NetDS91_2: DS91.2(K) DS92.1(A)
NetDS92_2: DS92.2(K) R174.2
NetDS93_2: DS93.2(K) DS94.1(A)
NetDS94_2: DS94.2(K) R175.2
NetDS95_2: DS95.2(K) DS96.1(A)
NetDS96_2: DS96.2(K) R176.2
NetDS97_2: DS97.2(K) DS98.1(A)
NetDS98_2: DS98.2(K) R183.2
NetDS99_2: DS99.2(K) DS100.1(A)
NetDS100_2: DS100.2(K) R184.2
NetDS101_2: DS101.2(K) DS102.1(A)
NetDS102_2: DS102.2(K) R185.2
NetDS103_2: DS103.2(K) DS104.1(A)
NetDS104_2: DS104.2(K) R186.2
NetDS105_2: DS105.2(K) DS106.1(A)
NetDS106_2: DS106.2(K) R187.2
NetDS107_2: DS107.2(K) DS108.1(A)
NetDS108_2: DS108.2(K) R188.2
NetDS109_2: DS109.2(K) DS110.1(A)
NetDS110_2: DS110.2(K) R189.2
NetDS111_2: DS111.2(K) DS112.1(A)
NetDS112_2: DS112.2(K) R190.2
NetDS113_2: DS113.2(K) DS114.1(A)
NetDS114_2: DS114.2(K) R191.2
NetDS115_2: DS115.2(K) DS116.1(A)
NetDS116_2: DS116.2(K) R192.2
NetDS117_2: DS117.2(K) DS118.1(A)
NetDS118_2: DS118.2(K) R193.2
NetDS119_2: DS119.2(K) DS120.1(A)
NetDS120_2: DS120.2(K) R194.2
NetDS121_2: DS121.2(K) DS122.1(A)
NetDS122_2: DS122.2(K) R201.2
NetDS123_2: DS123.2(K) DS124.1(A)
NetDS124_2: DS124.2(K) R202.2
NetDS125_2: DS125.2(K) DS126.1(A)
NetDS126_2: DS126.2(K) R203.2
NetDS127_2: DS127.2(K) DS128.1(A)
NetDS128_2: DS128.2(K) R204.2
NetDS129_2: DS129.2(K) DS130.1(A)
NetDS130_2: DS130.2(K) R205.2
NetDS131_2: DS131.2(K) DS132.1(A)
NetDS132_2: DS132.2(K) R206.2
NetDS133_2: DS133.2(K) DS134.1(A)
NetDS134_2: DS134.2(K) R207.2
NetDS135_2: DS135.2(K) DS136.1(A)
NetDS136_2: DS136.2(K) R208.2
NetDS137_2: DS137.2(K) DS138.1(A)
NetDS138_2: DS138.2(K) R209.2
NetDS139_2: DS139.2(K) DS140.1(A)
NetDS140_2: DS140.2(K) R210.2
NetDS141_2: DS141.2(K) DS142.1(A)
NetDS142_2: DS142.2(K) R211.2
NetDS143_2: DS143.2(K) DS144.1(A)
NetDS144_2: DS144.2(K) R212.2
NetDS145_2: DS145.2(K) DS146.1(A)
NetDS146_2: DS146.2(K) R219.2
NetDS147_2: DS147.2(K) DS148.1(A)
NetDS148_2: DS148.2(K) R220.2
NetDS149_2: DS149.2(K) DS150.1(A)
NetDS150_2: DS150.2(K) R221.2
NetDS151_2: DS151.2(K) DS152.1(A)
NetDS152_2: DS152.2(K) R222.2
NetDS153_2: DS153.2(K) DS154.1(A)
NetDS154_2: DS154.2(K) R223.2
NetDS155_2: DS155.2(K) DS156.1(A)
NetDS156_2: DS156.2(K) R224.2
NetDS157_2: DS157.2(K) DS158.1(A)
NetDS158_2: DS158.2(K) R225.2
NetDS159_2: DS159.2(K) DS160.1(A)
NetDS160_2: DS160.2(K) R226.2
NetDS161_2: DS161.2(K) DS162.1(A)
NetDS162_2: DS162.2(K) R227.2
NetDS163_2: DS163.2(K) DS164.1(A)
NetDS164_2: DS164.2(K) R228.2
NetDS165_2: DS165.2(K) DS166.1(A)
NetDS166_2: DS166.2(K) R229.2
NetDS167_2: DS167.2(K) DS168.1(A)
NetDS168_2: DS168.2(K) R230.2
NetJ3_1: J3.1(14GA_WIRE) J7.1(14GA_WIRE) R5.2 U5.7(CANH)
NetJ4_1: J4.1(14GA_WIRE) J8.1(14GA_WIRE) R5.1 U5.6(CANL)
NetJ9_1: J9.1(14GA_WIRE) R59.2 U11.5(VOUT1)
NetJ10_1: J10.1(14GA_WIRE) U11.8(VOUT2)
NetJ11_1: J11.1 R33.2
NetJ11_2: J11.2 R35.2
NetJ11_3: J11.3 R37.2
NetJ11_4: J11.4 R39.2
NetJ11_5: J11.5 R41.2
NetJ11_8: J11.8 Q5.2(D)
NetJ11_9: J11.9 Q4.2(D)
NetJ11_10: J11.10 Q3.2(D)
NetJ11_11: J11.11 Q2.2(D)
NetJ11_12: J11.12 Q1.2(D)
NetJ12_1: J12.1 R43.2
NetJ12_2: J12.2 R45.2
NetJ12_3: J12.3 R47.2
NetJ12_4: J12.4 R49.2
NetJ12_5: J12.5 R51.2
NetJ12_8: J12.8 Q10.2(D)
NetJ12_9: J12.9 Q9.2(D)
NetJ12_10: J12.10 Q8.2(D)
NetJ12_11: J12.11 Q7.2(D)
NetJ12_12: J12.12 Q6.2(D)
NetJ13_1: J13.1 R3.1 U3.9(~{MCLR}) ; port MCLR
NetJ15_2: J15.2 U15.13(T1OUT)
NetJ15_3: J15.3 U15.8(R1IN)
NetJ16_1: J16.1 R84.2
NetJ16_2: J16.2 R86.2
NetJ16_3: J16.3 R88.2
NetJ16_4: J16.4 R90.2
NetJ16_5: J16.5 R92.2
NetJ16_8: J16.8 Q15.2(D)
NetJ16_9: J16.9 Q14.2(D)
NetJ16_10: J16.10 Q13.2(D)
NetJ16_11: J16.11 Q12.2(D)
NetJ16_12: J16.12 Q11.2(D)
NetJ17_1: J17.1 R94.2
NetJ17_2: J17.2 R96.2
NetJ17_3: J17.3 R98.2
NetJ17_4: J17.4 R100.2
NetJ17_5: J17.5 R102.2
NetJ17_8: J17.8 Q20.2(D)
NetJ17_9: J17.9 Q19.2(D)
NetJ17_10: J17.10 Q18.2(D)
NetJ17_11: J17.11 Q17.2(D)
NetJ17_12: J17.12 Q16.2(D)
NetJ18_3: J18.3 R75.2(T)
NetJ18_4: J18.4 R76.2
NetJ18_5: J18.5 R77.2
NetJ18_6: J18.6 R78.2
NetJ18_7: J18.7 R20.2
NetJ18_8: J18.8 R21.2
NetJ18_9: J18.9 R22.2
NetJ18_10: J18.10 R23.2
NetJ18_11: J18.11 R24.2
NetJ18_12: J18.12 R25.2
NetJ18_13: J18.13 R26.2
NetJ18_14: J18.14 R27.2
NetJ18_15: J18.15 R79.2
NetJ18_16: J18.16 R80.2
NetJ18_17: J18.17 R81.2
NetJ18_19: J18.19 R67.2
NetJ18_20: J18.20 Q21.2(D)
NetJ19_1: J19.1 U26.2(VBAT) ; port VBAT
NetJ19_4: J19.4 R233.2 R234.2 ; port LIGHT_SENSOR NEG
NetJ19_6: J19.6 R232.2 ; port LIGHT_SENSOR POS
NetQ1_1: Q1.1(G) R6.2
NetQ2_1: Q2.1(G) R7.2
NetQ3_1: Q3.1(G) R8.2
NetQ4_1: Q4.1(G) R9.2
NetQ5_1: Q5.1(G) R10.2
NetQ6_1: Q6.1(G) R11.2
NetQ7_1: Q7.1(G) R12.2
NetQ8_1: Q8.1(G) R13.2
NetQ9_1: Q9.1(G) R14.2
NetQ10_1: Q10.1(G) R15.2
NetQ11_1: Q11.1(G) R62.2
NetQ12_1: Q12.1(G) R63.2
NetQ13_1: Q13.1(G) R64.2
NetQ14_1: Q14.1(G) R65.2
NetQ15_1: Q15.1(G) R66.2
NetQ16_1: Q16.1(G) R69.2
NetQ17_1: Q17.1(G) R70.2
NetQ18_1: Q18.1(G) R71.2
NetQ19_1: Q19.1(G) R72.2
NetQ20_1: Q20.1(G) R73.2
NetQ21_1: Q21.1(G) R83.2
NetQ22_1: Q22.1(B) R105.2
NetQ22_3: Q22.3(C) R111.1 R117.1
NetQ23_1: Q23.1(B) R106.2
NetQ23_3: Q23.3(C) R112.1 R118.1
NetQ24_1: Q24.1(B) R107.2
NetQ24_3: Q24.3(C) R113.1 R119.1
NetQ25_1: Q25.1(B) R108.2
NetQ25_3: Q25.3(C) R114.1 R120.1
NetQ26_1: Q26.1(B) R109.2
NetQ26_3: Q26.3(C) R115.1 R121.1
NetQ27_1: Q27.1(B) R110.2
NetQ27_3: Q27.3(C) R116.1 R122.1
NetQ28_1: Q28.1(B) R123.2
NetQ28_3: Q28.3(C) R129.1 R135.1
NetQ29_1: Q29.1(B) R124.2
NetQ29_3: Q29.3(C) R130.1 R136.1
NetQ30_1: Q30.1(B) R125.2
NetQ30_3: Q30.3(C) R131.1 R137.1
NetQ31_1: Q31.1(B) R126.2
NetQ31_3: Q31.3(C) R132.1 R138.1
NetQ32_1: Q32.1(B) R127.2
NetQ32_3: Q32.3(C) R133.1 R139.1
NetQ33_1: Q33.1(B) R128.2
NetQ33_3: Q33.3(C) R134.1 R140.1
NetQ34_1: Q34.1(B) R141.2
NetQ34_3: Q34.3(C) R147.1 R153.1
NetQ35_1: Q35.1(B) R142.2
NetQ35_3: Q35.3(C) R148.1 R154.1
NetQ36_1: Q36.1(B) R143.2
NetQ36_3: Q36.3(C) R149.1 R155.1
NetQ37_1: Q37.1(B) R144.2
NetQ37_3: Q37.3(C) R150.1 R156.1
NetQ38_1: Q38.1(B) R145.2
NetQ38_3: Q38.3(C) R151.1 R157.1
NetQ39_1: Q39.1(B) R146.2
NetQ39_3: Q39.3(C) R152.1 R158.1
NetQ40_1: Q40.1(B) R159.2
NetQ40_3: Q40.3(C) R165.1 R171.1
NetQ41_1: Q41.1(B) R160.2
NetQ41_3: Q41.3(C) R166.1 R172.1
NetQ42_1: Q42.1(B) R161.2
NetQ42_3: Q42.3(C) R167.1 R173.1
NetQ43_1: Q43.1(B) R162.2
NetQ43_3: Q43.3(C) R168.1 R174.1
NetQ44_1: Q44.1(B) R163.2
NetQ44_3: Q44.3(C) R169.1 R175.1
NetQ45_1: Q45.1(B) R164.2
NetQ45_3: Q45.3(C) R170.1 R176.1
NetQ46_1: Q46.1(B) R177.2
NetQ46_3: Q46.3(C) R183.1 R189.1
NetQ47_1: Q47.1(B) R178.2
NetQ47_3: Q47.3(C) R184.1 R190.1
NetQ48_1: Q48.1(B) R179.2
NetQ48_3: Q48.3(C) R185.1 R191.1
NetQ49_1: Q49.1(B) R180.2
NetQ49_3: Q49.3(C) R186.1 R192.1
NetQ50_1: Q50.1(B) R181.2
NetQ50_3: Q50.3(C) R187.1 R193.1
NetQ51_1: Q51.1(B) R182.2
NetQ51_3: Q51.3(C) R188.1 R194.1
NetQ52_1: Q52.1(B) R195.2
NetQ52_3: Q52.3(C) R201.1 R207.1
NetQ53_1: Q53.1(B) R196.2
NetQ53_3: Q53.3(C) R202.1 R208.1
NetQ54_1: Q54.1(B) R197.2
NetQ54_3: Q54.3(C) R203.1 R209.1
NetQ55_1: Q55.1(B) R198.2
NetQ55_3: Q55.3(C) R204.1 R210.1
NetQ56_1: Q56.1(B) R199.2
NetQ56_3: Q56.3(C) R205.1 R211.1
NetQ57_1: Q57.1(B) R200.2
NetQ57_3: Q57.3(C) R206.1 R212.1
NetQ58_1: Q58.1(B) R213.2
NetQ58_3: Q58.3(C) R219.1 R225.1
NetQ59_1: Q59.1(B) R214.2
NetQ59_3: Q59.3(C) R220.1 R226.1
NetQ60_1: Q60.1(B) R215.2
NetQ60_3: Q60.3(C) R221.1 R227.1
NetQ61_1: Q61.1(B) R216.2
NetQ61_3: Q61.3(C) R222.1 R228.1
NetQ62_1: Q62.1(B) R217.2
NetQ62_3: Q62.3(C) R223.1 R229.1
NetQ63_1: Q63.1(B) R218.2
NetQ63_3: Q63.3(C) R224.1 R230.1
NetR2_2: R2.2 U2.1(~{HOLD}) U6.1(~{HOLD}) U9.1(~{HOLD}) U13.1(~{HOLD})
NetR17_2: R17.2 U7.7(~{ON}/OFF)
NetR18_2: R18.2 R29.1 U7.6(FB)
NetR32_1: R32.1 U3.50(OSC2/CLK0/RC15) U4.4(MCLK) ; port MCLK
NetR53_2: R53.2 R59.1 U11.4(IN-)
NetR105_1: R105.1 U19.19(Q1)
NetR106_1: R106.1 U20.19(Q1)
NetR107_1: R107.1 U21.19(Q1)
NetR108_1: R108.1 U22.19(Q1)
NetR109_1: R109.1 U23.19(Q1)
NetR110_1: R110.1 U24.19(Q1)
NetR123_1: R123.1 U19.18(Q2)
NetR124_1: R124.1 U20.18(Q2)
NetR125_1: R125.1 U21.18(Q2)
NetR126_1: R126.1 U22.18(Q2)
NetR127_1: R127.1 U23.18(Q2)
NetR128_1: R128.1 U24.18(Q2)
NetR141_1: R141.1 U19.17(Q3)
NetR142_1: R142.1 U20.17(Q3)
NetR143_1: R143.1 U21.17(Q3)
NetR144_1: R144.1 U22.17(Q3)
NetR145_1: R145.1 U23.17(Q3)
NetR146_1: R146.1 U24.17(Q3)
NetR159_1: R159.1 U19.16(Q4)
NetR160_1: R160.1 U20.16(Q4)
NetR161_1: R161.1 U21.16(Q4)
NetR162_1: R162.1 U22.16(Q4)
NetR163_1: R163.1 U23.16(Q4)
NetR164_1: R164.1 U24.16(Q4)
NetR177_1: R177.1 U19.15(Q5)
NetR178_1: R178.1 U20.15(Q5)
NetR179_1: R179.1 U21.15(Q5)
NetR180_1: R180.1 U22.15(Q5)
NetR181_1: R181.1 U23.15(Q5)
NetR182_1: R182.1 U24.15(Q5)
NetR195_1: R195.1 U19.14(Q6)
NetR196_1: R196.1 U20.14(Q6)
NetR197_1: R197.1 U21.14(Q6)
NetR198_1: R198.1 U22.14(Q6)
NetR199_1: R199.1 U23.14(Q6)
NetR200_1: R200.1 U24.14(Q6)
NetR213_1: R213.1 U19.13(Q7)
NetR214_1: R214.1 U20.13(Q7)
NetR215_1: R215.1 U21.13(Q7)
NetR216_1: R216.1 U22.13(Q7)
NetR217_1: R217.1 U23.13(Q7)
NetR218_1: R218.1 U24.13(Q7)
NetR233_1: R233.1 U3.17(AN3/CN5/RB3)
NetU1_11: U1.11(LE) U25.9(~{Y}6) ; port CLK6
NetU3_29: U3.29(AN10/RB10) U3.30(AN11/RB11)
NetU14_11: U14.11(LE) U25.7(~{Y}7) ; port CLK7
NetU19_11: U19.11(LE) U25.15(~{Y}0) ; port CLK0
NetU20_11: U20.11(LE) U25.14(~{Y}1) ; port CLK1
NetU21_11: U21.11(LE) U25.13(~{Y}2) ; port CLK2
NetU22_11: U22.11(LE) U25.12(~{Y}3) ; port CLK3
NetU23_11: U23.11(LE) U25.11(~{Y}4) ; port CLK4
NetU24_11: U24.11(LE) U25.10(~{Y}5) ; port CLK5
NetU26_3: U26.3(X1) Y2.1(OSC1)
NetU26_5: U26.5(X2) Y2.4(OSC2)

Not connected (* = marked no-connect by the designer): D2 1(NC); J13 6; J14 5(SHLD) 6(SHLD); J15 1 4 6 7 8 9; J18 18; J19 2 5; U3 16(AN4/IC7/CN6/RB4); U4 7(AOUTL); U5 5(VREF); U7 5(NC); U14 12(Q8); U16 1(DCD) 2(RI) 11(~{SUSPEND}) 12(SUSPEND) 23(CTS) 24(RTS) 27(DSR) 28(DTR); U17 1(BOOST) 6(LV) 7(OSC); U26 4(NC) 6(NC) 7(~{INT0}) 8(~{INT1}) 9(1Hz) 13(NC) 18(32KHz) 19(NC); Y2 2(COM) 3(COM)

### Layout directives
net class Class_Lamp: NetJ11_8, NetJ11_9, NetJ11_10, NetJ11_11, NetJ11_12, NetJ12_8, NetJ12_9, NetJ12_10, NetJ12_11, NetJ12_12, NetJ16_8, NetJ16_9, NetJ16_10, NetJ16_11, NetJ16_12, NetJ17_8, NetJ17_9, NetJ17_10, NetJ17_11, NetJ17_12, Vbat

### Notes on the sheet
- 2.2V 20mA 44mW
- (near R117) .066 W
- (near R135) .066 W
- (near R153) .066 W
- (near R171) .066 W
- (near R189) .066 W
- (near R207) .066 W
- (near R225) .066 W
- (near Q22) hfe 100+ 0.3V
- (near Q28) hfe 100+ 0.3V
- (near Q34) hfe 100+ 0.3V
- (near Q40) hfe 100+ 0.3V
- (near Q46) hfe 100+ 0.3V
- (near Q52) hfe 100+ 0.3V
- (near Q58) hfe 100+ 0.3V
- (near U10) MAKE SURE THIS GETS POWER!
- (near R118) .066 W
- (near R136) .066 W
- (near R154) .066 W
- (near R172) .066 W
- (near R190) .066 W
- (near R208) .066 W
- (near R226) .066 W
- (near Q23) hfe 100+ 0.3V
- (near Q29) hfe 100+ 0.3V
- (near Q35) hfe 100+ 0.3V
- (near Q41) hfe 100+ 0.3V
- (near Q47) hfe 100+ 0.3V
- (near Q53) hfe 100+ 0.3V
- (near Q59) hfe 100+ 0.3V
- (near R119) .066 W
- (near R137) .066 W
- (near R155) .066 W
- (near R173) .066 W
- (near R191) .066 W
- (near R209) .066 W
- (near R227) .066 W
- (near R29) SUPPLY DESIGNED FOR 1.5A
- (near Q24) hfe 100+ 0.3V
- (near Q30) hfe 100+ 0.3V
- (near Q36) hfe 100+ 0.3V
- (near Q42) hfe 100+ 0.3V
- (near Q48) hfe 100+ 0.3V
- (near Q54) hfe 100+ 0.3V
- (near Q60) hfe 100+ 0.3V
- (near J18) VSS
- (near J18) VDD
- (near J18) VL
- (near J18) R/W
- (near J18) D/I
- (near R5) TERMINATE MASTER ONLY
- (near J18) E
- (near J18) DB0
- (near J18) DB1
- (near J18) DB2
- (near J18) DB3
- (near J18) DB4
- (near J18) DB5
- (near J18) DB6
- (near J18) DB7
- (near J18) CS1
- (near J4) DAISY CHAIN CONNECTORS
- (near J18) CS2
- (near J18) RESET
- (near J18) VEE
- (near J18) A
- (near J18) K
- 3.4V 20mA 68mW
- (near R120) .066 W
- (near R138) .066 W
- (near R156) .066 W
- (near R174) .066 W
- (near R192) .066 W
- (near R210) .066 W
- (near R228) .066 W
- (near Q25) hfe 100+ 0.3V
- (near Q31) hfe 100+ 0.3V
- (near Q37) hfe 100+ 0.3V
- (near Q43) hfe 100+ 0.3V
- (near Q49) hfe 100+ 0.3V
- (near Q55) hfe 100+ 0.3V
- (near Q61) hfe 100+ 0.3V
- WORRY ABOUT MAX COMPONENT HEIGHT
- FOSC=12.288E6
- SPEAKER +
- (near J13) PROGRAMMING PORT
- USE /3 INP & PLL * 8 = 32.7696E6
- FCY= /4 = 8.1924E6, TCY = 122E-9
- SPEAKER -
- MIPS=8.192
- FCAN=FCY=8.1924E6
- (near C5) CANCKS=1 FOR /4 BECAUSE >7.5MHz
- (near R121) .066 W
- (near R139) .066 W
- (near R157) .066 W
- (near R175) .066 W
- (near R193) .066 W
- (near R211) .066 W
- (near R229) .066 W
- TQ=125ns
- UNIQUE ID
- (near Q26) hfe 100+ 0.3V
- (near Q32) hfe 100+ 0.3V
- (near Q38) hfe 100+ 0.3V
- (near Q44) hfe 100+ 0.3V
- (near Q50) hfe 100+ 0.3V
- (near Q56) hfe 100+ 0.3V
- (near Q62) hfe 100+ 0.3V
- SCORE DISPLAY ID RESISTOR
- MASTER ID RESISTOR
- (near R122) .066 W
- (near R140) .066 W
- (near R158) .066 W
- (near R176) .066 W
- (near R194) .066 W
- (near R212) .066 W
- (near R230) .066 W
- (near Q27) hfe 100+ 0.3V
- (near Q33) hfe 100+ 0.3V
- (near Q39) hfe 100+ 0.3V
- (near Q45) hfe 100+ 0.3V
- (near Q51) hfe 100+ 0.3V
- (near Q57) hfe 100+ 0.3V
- (near Q63) hfe 100+ 0.3V
- LM4861 Shutdown 0.6uA
- SN65HVD230 Standby 370uA
- SN74HC595DW spec 80uA @ 6V * 4 - Probably much less at 3.3
- CS4344 100uA with clk/data static
- dsPIC ???
- MMA7260 500uA & only 3uA sleep
- PLAYWORLD BUTTON BOARD
- LM2676 at least 4.2mA + switching loss
- SEPARATE PATHS FOR LED VCC/GND
- SEPARATE PATHS FOR AUDIO AMP VCC/GND
- NEED A P/N
- 1
- A
- M25P64 50uA in stby
- A.S.